# EasyEDA Pro project ProPrj_IRIS_2026-04-15_COMPLETE.epro, board PCB1
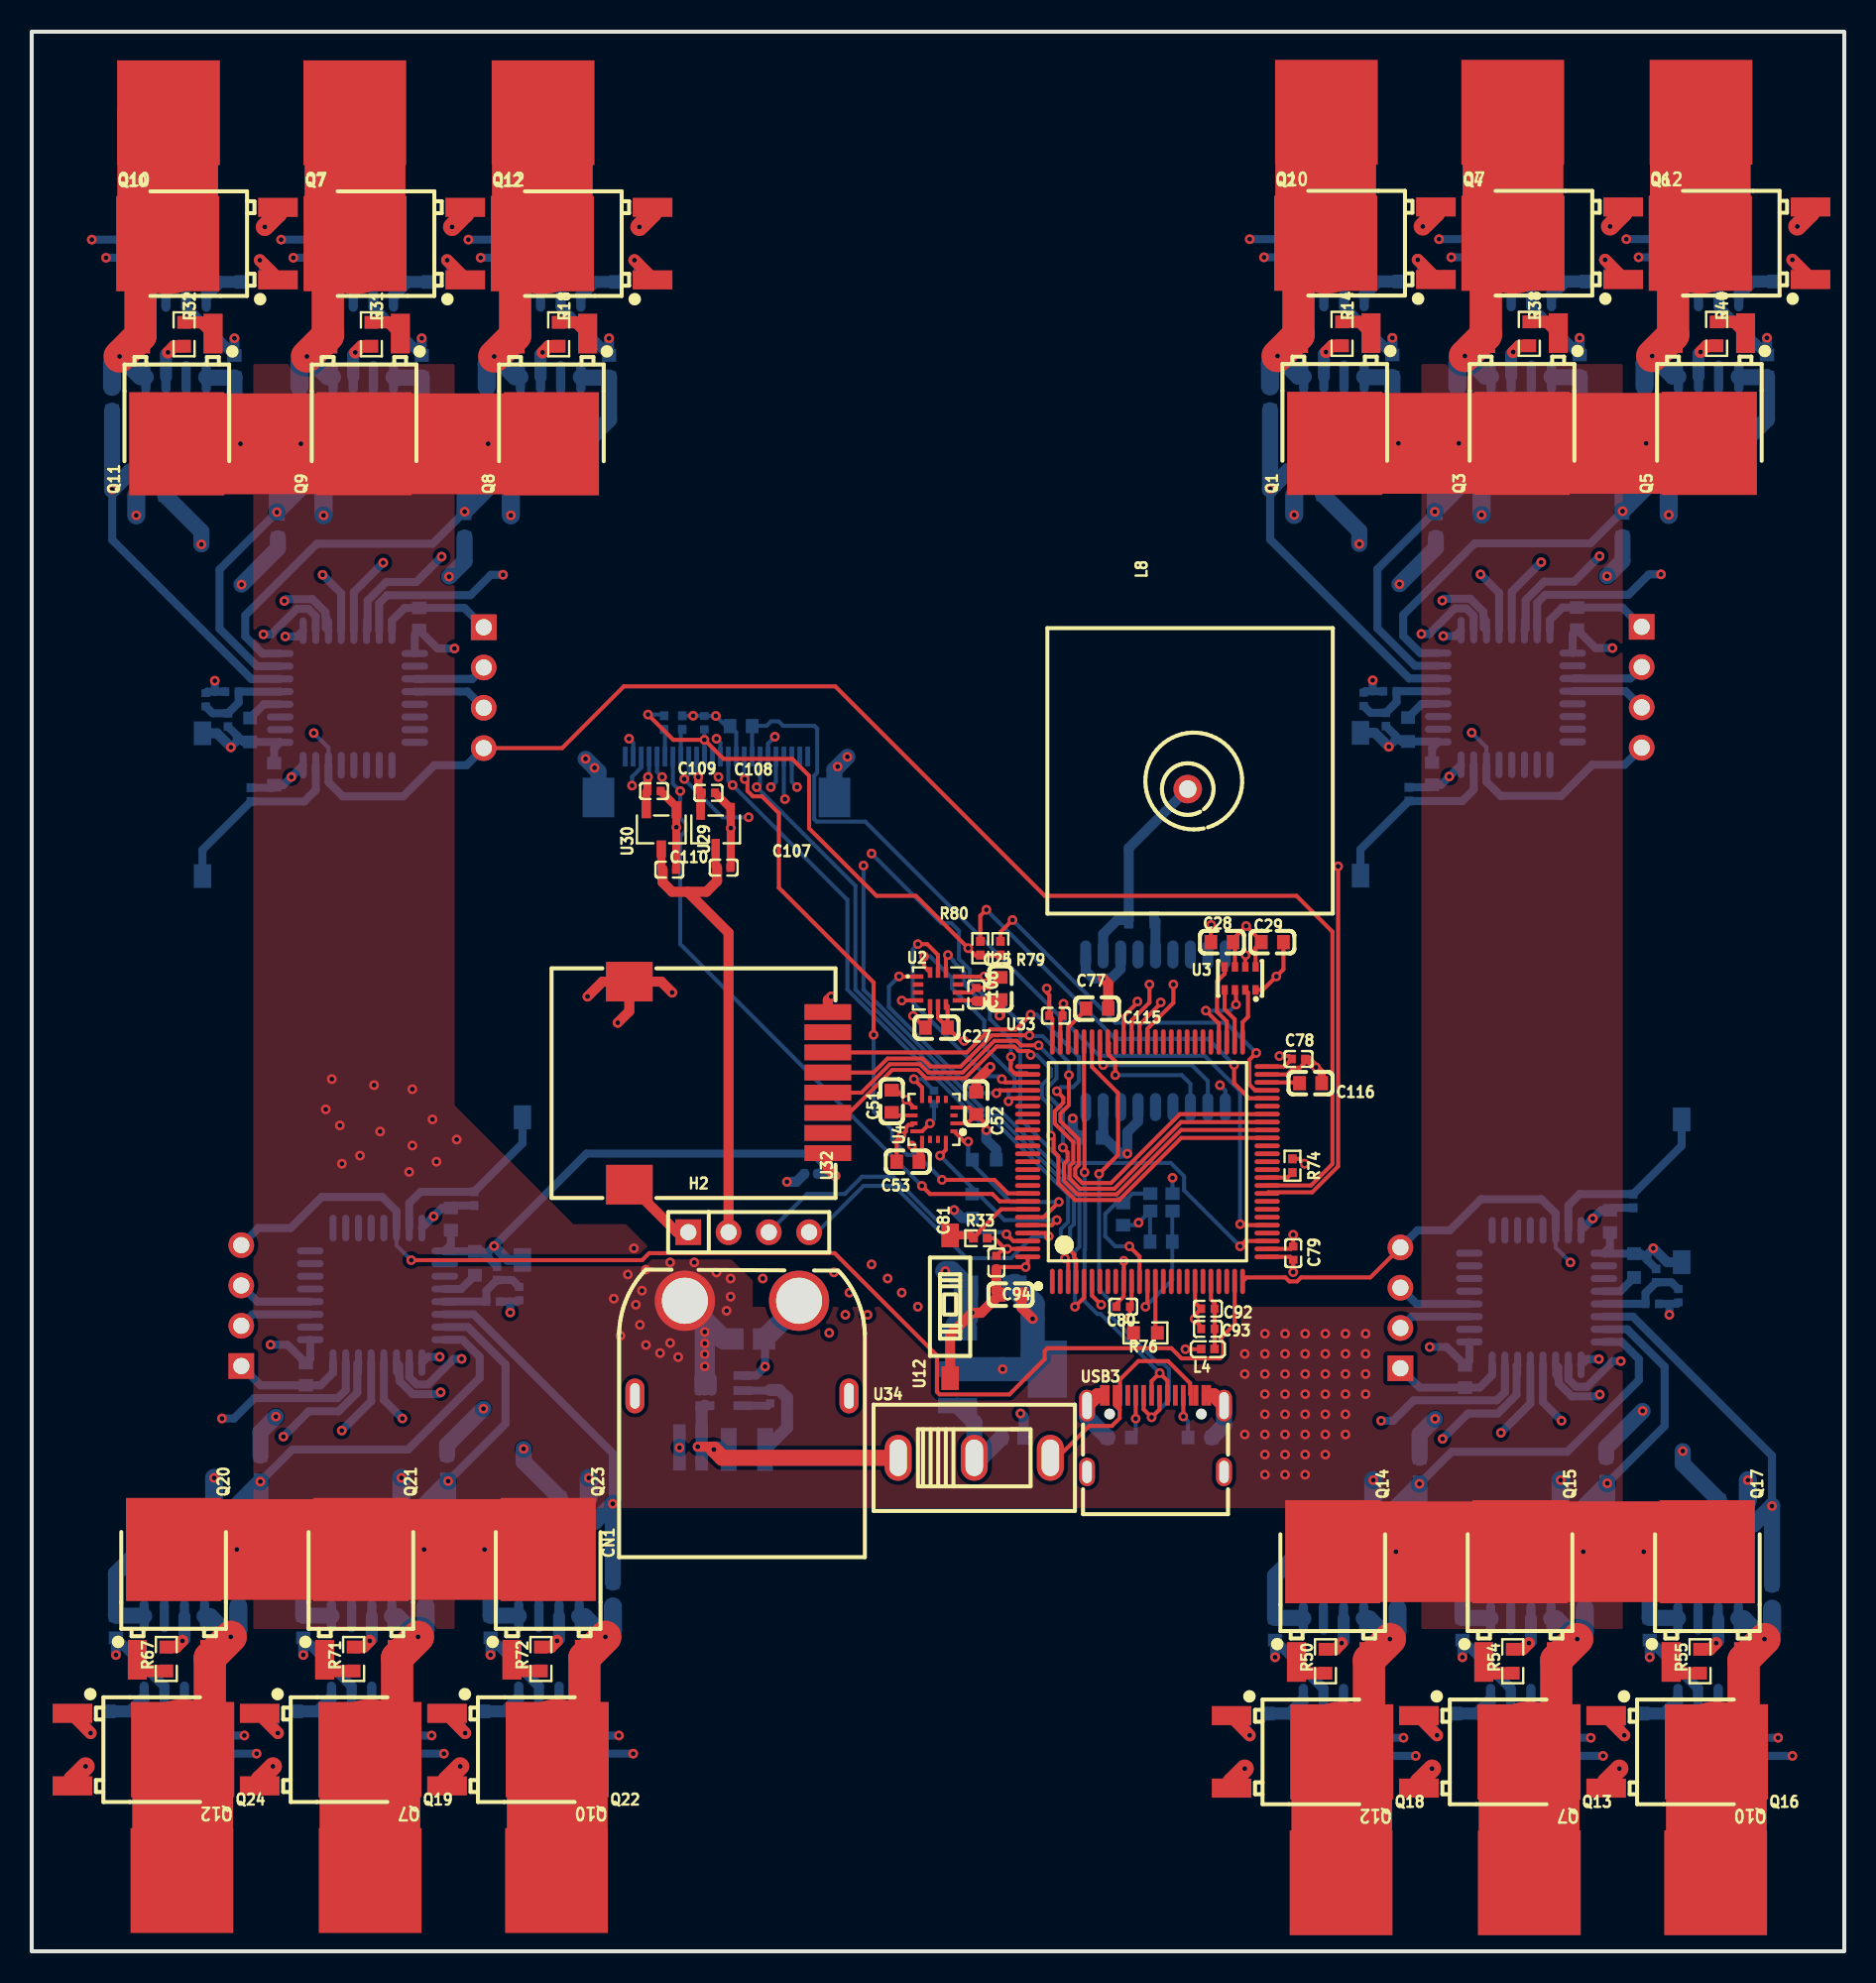
[diagram p2: board, top side]
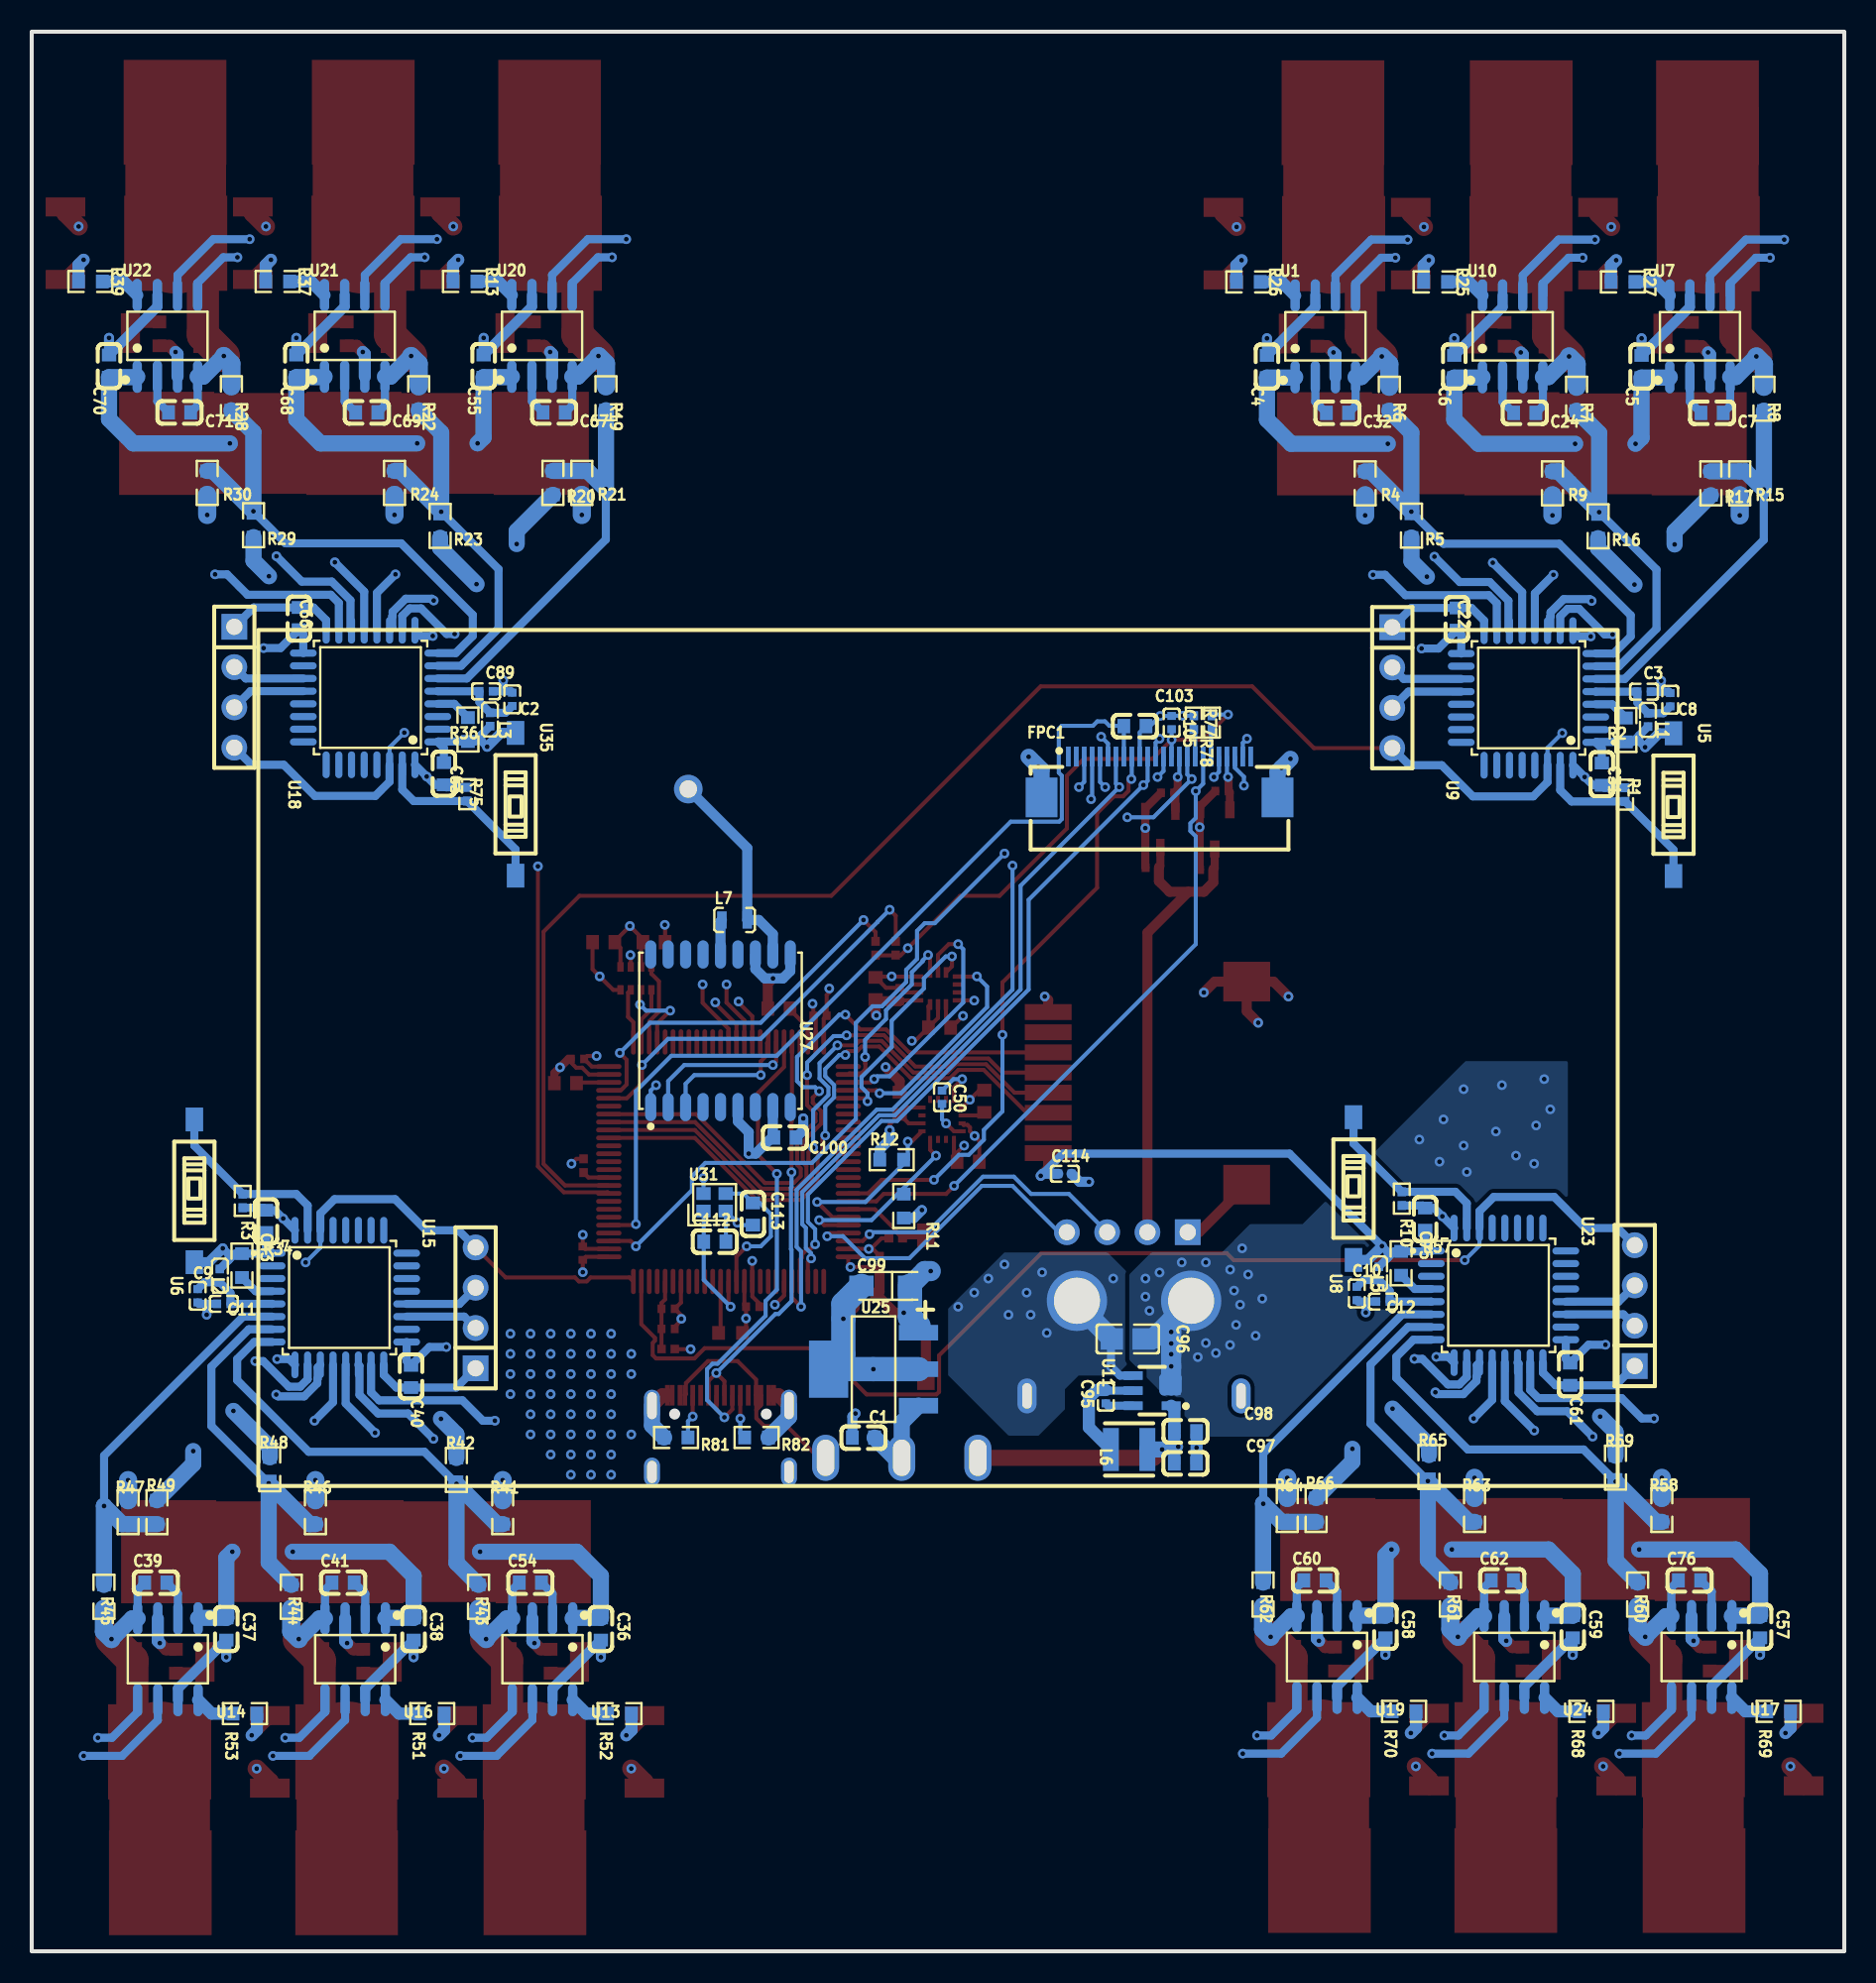
[diagram p3: board, bottom side, seen from below]

Outline 114.3 x 121.03 mm; copper layers: Top Layer, Ground, Power, Bottom Layer. Coordinates in mm from the lower left corner of the outline.
Outline path: rectangle 0,121.03 114.3,0
Stack: Top Layer 0.035mm Outer layer thickness 1oz / Dielectric1 0.2104mm 7628 RC49% 8.6mil / Ground 0.0152mm Inner layer thickness / Dielectric2 1.065mm 1.1mm H/HOZ Copper / Power 0.0152mm Inner layer thickness / Dielectric3 0.2104mm 7628 RC49% 8.6mil / Bottom Layer 0.035mm Outer layer thickness 1oz

## Design rules (mm)
template: Custom Config
spacing copperThickness1oz (default): track to track 0.102, other pairs 0.152 to 0.3
spacing copperThickness2oz: track to track 0.203, other pairs 0.152 to 0.3
track width copperThickness1oz (default): min 0.127, default 0.254, max 2.54
track width copperThickness2oz: min 0.203, default 0.254, max 2.54
differential pair differentialPair (default): width min 0.127, default 0.254, max 2.54; gap min 0.152, default 0.152
via viaSize (default): diameter min 0.5, default 0.61, max 10; hole min 0.3, default 0.305, max 6.3
pour e3935 uses copperRegion1
pour e4184 uses copperRegion1
pour e4060 uses copperRegion1
pour e4111 uses copperRegion1
pour e4183 uses copperRegion1
pour e397 uses copperRegion1
pour e567 uses copperRegion1
pour e182 uses copperRegion1
pour e292 uses copperRegion1
pour e393 uses copperRegion1

## Placement (name value [footprint] x y rotation side)
C1  10uF  [C0603]  61.85 32.38 180 bottom
C2  1uF  [C0402]  84 78.94 270 bottom
C3  100nF  [C0402]  12.63 79.42 180 bottom
C4  10uF  [C0603]  36.41 99.92 270 bottom
C5  10uF  [C0603]  12.78 99.92 270 bottom
C6  10uF  [C0603]  24.59 99.92 270 bottom
C7  100nF  [C0603]  8.34 97 0 bottom
C8  1uF  [C0402]  10.98 78.91 270 bottom
C9  1uF  [C0402]  103.84 41.33 90 bottom
C10  1uF  [C0402]  30.74 41.47 90 bottom
C11  100nF  [C0402]  102.18 40.82 0 bottom
C12  100nF  [C0402]  29.09 40.96 0 bottom
C22  100nF  [C0603]  24.43 84 270 bottom
C24  100nF  [C0603]  20.15 97 0 bottom
C25  2.2uF  [C0603]  61.09 60.71 270 top
C27  10nF  [C0603]  57.05 58.24 180 top
C28  100nF  [C0603]  75.06 63.63 180 top
C29  100nF  [C0603]  78.23 63.63 0 top
C31  100nF  [C0603]  15.29 74.22 270 bottom
C32  100nF  [C0603]  31.96 97 0 bottom
C36  10uF  [C0603]  78.41 20.32 90 bottom
C37  10uF  [C0603]  102.03 20.32 90 bottom
C38  10uF  [C0603]  90.22 20.32 90 bottom
C39  100nF  [C0603]  106.48 23.24 180 bottom
C40  100nF  [C0603]  90.38 36.24 90 bottom
C41  100nF  [C0603]  94.66 23.24 180 bottom
C43  100nF  [C0603]  99.53 46.02 90 bottom
C50  220nF  [C0402]  56.9 53.85 270 bottom
C51  4.7uF  [C0603]  54.23 53.59 90 top
C52  100nF  [C0603]  59.56 53.47 90 top
C53  100nF  [C0603]  55.25 49.78 180 top
C54  100nF  [C0603]  82.85 23.24 180 bottom
C55  10uF  [C0603]  85.8 99.95 270 bottom
C57  10uF  [C0603]  5.31 20.46 90 bottom
C58  10uF  [C0603]  28.94 20.46 90 bottom
C59  10uF  [C0603]  17.12 20.46 90 bottom
C60  100nF  [C0603]  33.38 23.38 180 bottom
C61  100nF  [C0603]  17.29 36.39 90 bottom
C62  100nF  [C0603]  21.57 23.38 180 bottom
C63  100nF  [C0603]  88.31 74.25 270 bottom
C66  100nF  [C0603]  97.45 84.03 270 bottom
C67  100nF  [C0603]  81.36 97.03 0 bottom
C68  10uF  [C0603]  97.61 99.95 270 bottom
C69  100nF  [C0603]  93.17 97.03 0 bottom
C70  10uF  [C0603]  109.42 99.95 270 bottom
C71  100nF  [C0603]  104.98 97.03 0 bottom
C75  100nF  [C0603]  26.43 46.16 90 bottom
C76  100nF  [C0603]  9.76 23.38 180 bottom
C77  100nF  [C0402]  64.59 58.99 180 top
C78  100nF  [C0402]  79.88 56.26 180 top
C79  100nF  [C0402]  79.55 44.02 90 top
C80  100nF  [C0402]  68.83 40.64 0 top
C81  100nF  [C0402]  60.83 43.43 270 top
C89  100nF  [C0402]  85.65 79.45 180 bottom
C92  100nF  [C0402]  74.17 40.51 0 top
C93  1uF  [C0402]  74.17 39.24 0 top
C94  4.7uF  [C0603]  61.72 41.4 0 top
C95  100nF  [C0402]  46.57 34.97 270 bottom
C96  10uF  [C0805]  45.18 38.61 180 bottom
C97  22uF  [C0603]  41.55 30.76 0 bottom
C98  22uF  [C0603]  41.54 32.78 0 bottom
C99  10uF  [CAP-SMD_L3.2-W1.6-RD-C7171]  60.45 41.96 0 bottom
C100  10uF  [C0603]  66.8 51.31 0 bottom
C103  15pF  [C0603]  44.73 77.25 0 bottom
C105  100nF  [C0402]  42.42 77.47 270 bottom
C106  100nF  [C0402]  59.56 60.32 90 top
C107  1uF  [C0402]  43.64 68.33 180 top
C108  1uF  [C0402]  42.67 73.04 180 top
C109  1uF  [C0402]  39.24 73.15 180 top
C110  1uF  [C0402]  40.21 68.2 180 top
C112  10pF  [C0603]  71.22 44.74 180 bottom
C113  10pF  [C0603]  68.82 46.48 270 bottom
C114  100nF  [C0402]  49.15 49.02 180 bottom
C115  2.2uF  [C0603]  67.18 59.44 180 top
C116  2.2uF  [C0603]  80.65 54.74 180 top
CN1  XT60PW-M  [CONN-TH_XT60PW-M]  44.79 38.02 90 top
FPC1  FPC-05F-24PH20  [FPC-SMD_24P-P0.50_FPC-05F-24PH20]  43.18 74.04 180 bottom
H1  HX PH254-01-04-Z-L11.5 straight pin header  [HDR-TH_4P-HX-PH254-01-04-Z-L11.5]  101.52 79.7 270 bottom
H2  HX PH254-01-04-Z-L11.5 straight pin header  [HDR-TH_4P-HX-PH254-01-04-Z-L11.5]  45.21 45.34 0 top
H3  HX PH254-01-04-Z-L11.5 straight pin header  [HDR-TH_4P-HX-PH254-01-04-Z-L11.5]  28.5 79.67 270 bottom
H4  HX PH254-01-04-Z-L11.5 straight pin header  [HDR-TH_4P-HX-PH254-01-04-Z-L11.5]  86.31 40.57 90 bottom
H5  HX PH254-01-04-Z-L11.5 straight pin header  [HDR-TH_4P-HX-PH254-01-04-Z-L11.5]  13.21 40.71 90 bottom
L1  BLM15PD121SN1D  [L0402]  12.37 77.64 270 bottom
L2  BLM15PD121SN1D  [L0402]  102.44 42.6 90 bottom
L3  BLM15PD121SN1D  [L0402]  85.39 77.67 270 bottom
L4  BLM15PD121SN1D  [L0402]  74.17 37.97 0 top
L5  BLM15PD121SN1D  [L0402]  29.34 42.74 90 bottom
L6  4.7uH  [IND-SMD_L3.0-W3.0-1]  45.1 31.64 180 bottom
L7  47nH  [IND-SMD_L1.8-W1.0]  69.98 65.02 180 bottom
L8  BWGNSCNX18-18W4  [ANT-TH_L18.0-W18.0_C9900026472]  72.9 73.28 0 top
NOREF  -  [Pad_e2432]  9.47 4.46 0 top
NOREF#2  -  [Pad_e2002]  106.19 4.32 0 top
NOREF#3  -  [Pad_e844]  105.27 115.95 180 top
NOREF#4  -  [Pad_e843]  81.64 115.95 180 top
NOREF#5  -  [Pad_e2000]  94.44 4.32 0 top
NOREF#6  -  [Pad_e2433]  33.09 4.46 0 top
NOREF#7  -  [Pad_e4100]  20.37 115.92 180 top
NOREF#8  -  [Pad_e2431]  21.35 4.46 0 top
NOREF#9  -  [Pad_e2001]  82.57 4.32 0 top
NOREF#10  -  [Pad_e845]  93.39 115.95 180 top
NOREF#11  -  [Pad_e4103]  32.25 115.92 180 top
NOREF#12  -  [Pad_e4104]  8.62 115.92 180 top
Q1  IRLR7843TRPBF  [TO-252-3_L6.6-W6.1-P4.57-LS9.9-BR-CW]  82.17 98.55 90 top
Q2  IRLR7843TRPBF  [TO-252-3_L6.6-W6.1-P4.57-LS9.9-BR-CW]  85.07 107.7 0 top
Q3  IRLR7843TRPBF  [TO-252-3_L6.6-W6.1-P4.57-LS9.9-BR-CW]  93.98 98.55 90 top
Q4  IRLR7843TRPBF  [TO-252-3_L6.6-W6.1-P4.57-LS9.9-BR-CW]  96.88 107.7 0 top
Q5  IRLR7843TRPBF  [TO-252-3_L6.6-W6.1-P4.57-LS9.9-BR-CW]  105.79 98.55 90 top
Q6  IRLR7843TRPBF  [TO-252-3_L6.6-W6.1-P4.57-LS9.9-BR-CW]  108.69 107.7 0 top
Q7  IRLR7843TRPBF  [TO-252-3_L6.6-W6.1-P4.57-LS9.9-BR-CW]  23.86 107.67 0 top
Q8  IRLR7843TRPBF  [TO-252-3_L6.6-W6.1-P4.57-LS9.9-BR-CW]  32.77 98.52 90 top
Q9  IRLR7843TRPBF  [TO-252-3_L6.6-W6.1-P4.57-LS9.9-BR-CW]  20.96 98.52 90 top
Q10  IRLR7843TRPBF  [TO-252-3_L6.6-W6.1-P4.57-LS9.9-BR-CW]  12.05 107.67 0 top
Q11  IRLR7843TRPBF  [TO-252-3_L6.6-W6.1-P4.57-LS9.9-BR-CW]  9.15 98.52 90 top
Q12  IRLR7843TRPBF  [TO-252-3_L6.6-W6.1-P4.57-LS9.9-BR-CW]  35.68 107.67 0 top
Q13  IRLR7843TRPBF  [TO-252-3_L6.6-W6.1-P4.57-LS9.9-BR-CW]  90.95 12.57 180 top
Q14  IRLR7843TRPBF  [TO-252-3_L6.6-W6.1-P4.57-LS9.9-BR-CW]  82.04 21.72 270 top
Q15  IRLR7843TRPBF  [TO-252-3_L6.6-W6.1-P4.57-LS9.9-BR-CW]  93.85 21.72 270 top
Q16  IRLR7843TRPBF  [TO-252-3_L6.6-W6.1-P4.57-LS9.9-BR-CW]  102.76 12.57 180 top
Q17  IRLR7843TRPBF  [TO-252-3_L6.6-W6.1-P4.57-LS9.9-BR-CW]  105.66 21.72 270 top
Q18  IRLR7843TRPBF  [TO-252-3_L6.6-W6.1-P4.57-LS9.9-BR-CW]  79.14 12.57 180 top
Q19  IRLR7843TRPBF  [TO-252-3_L6.6-W6.1-P4.57-LS9.9-BR-CW]  17.85 12.71 180 top
Q20  IRLR7843TRPBF  [TO-252-3_L6.6-W6.1-P4.57-LS9.9-BR-CW]  8.95 21.86 270 top
Q21  IRLR7843TRPBF  [TO-252-3_L6.6-W6.1-P4.57-LS9.9-BR-CW]  20.76 21.86 270 top
Q22  IRLR7843TRPBF  [TO-252-3_L6.6-W6.1-P4.57-LS9.9-BR-CW]  29.67 12.71 180 top
Q23  IRLR7843TRPBF  [TO-252-3_L6.6-W6.1-P4.57-LS9.9-BR-CW]  32.57 21.86 270 top
Q24  IRLR7843TRPBF  [TO-252-3_L6.6-W6.1-P4.57-LS9.9-BR-CW]  6.04 12.71 180 top
R1  10kΩ  [R0402]  13.82 72.93 90 bottom
R2  10kΩ  [R0603]  13.77 77.01 90 bottom
R3  10kΩ  [R0402]  101 47.31 270 bottom
R4  10kΩ  [R0603]  30.21 92.56 90 bottom
R5  33kΩ  [R0603]  27.29 89.89 90 bottom
R6  33kΩ  [R0603]  28.69 97.89 90 bottom
R7  33kΩ  [R0603]  16.88 97.89 90 bottom
R8  33kΩ  [R0603]  5.07 97.89 90 bottom
R9  10kΩ  [R0603]  18.4 92.56 90 bottom
R10  10kΩ  [R0402]  27.9 47.45 270 bottom
R11  2.2kΩ  [R0603]  59.31 46.99 90 bottom
R12  2.2kΩ  [R0603]  60.07 49.91 180 bottom
R13  100Ω  [R0603]  86.98 105.28 0 bottom
R14  100Ω  [R0603]  82.63 101.98 90 top
R15  10kΩ  [R0603]  6.59 92.56 90 bottom
R16  33kΩ  [R0603]  15.52 89.85 90 bottom
R17  33kΩ  [R0603]  8.41 92.56 90 bottom
R18  100Ω  [R0603]  33.23 101.95 90 top
R19  33kΩ  [R0603]  78.09 97.92 90 bottom
R20  33kΩ  [R0603]  81.43 92.58 90 bottom
R21  10kΩ  [R0603]  79.61 92.58 90 bottom
R22  33kΩ  [R0603]  89.9 97.92 90 bottom
R23  33kΩ  [R0603]  88.54 89.87 90 bottom
R24  10kΩ  [R0603]  91.42 92.58 90 bottom
R25  100Ω  [R0603]  25.77 105.26 0 bottom
R26  100Ω  [R0603]  37.58 105.26 0 bottom
R27  100Ω  [R0603]  13.96 105.26 0 bottom
R28  33kΩ  [R0603]  101.71 97.92 90 bottom
R29  33kΩ  [R0603]  100.31 89.92 90 bottom
R30  10kΩ  [R0603]  103.23 92.58 90 bottom
R31  100Ω  [R0603]  21.42 101.95 90 top
R32  100Ω  [R0603]  9.61 101.95 90 top
R33  10kΩ  [R0402]  59.82 44.96 0 top
R34  10kΩ  [R0603]  101.04 43.24 270 bottom
R36  10kΩ  [R0603]  86.79 77.03 90 bottom
R37  100Ω  [R0603]  98.79 105.28 0 bottom
R38  100Ω  [R0603]  94.44 101.98 90 top
R39  100Ω  [R0603]  110.6 105.28 0 bottom
R40  100Ω  [R0603]  106.25 101.98 90 top
R41  10kΩ  [R0603]  84.6 27.69 270 bottom
R42  33kΩ  [R0603]  87.52 30.35 270 bottom
R43  33kΩ  [R0603]  86.12 22.35 270 bottom
R44  33kΩ  [R0603]  97.93 22.35 270 bottom
R45  33kΩ  [R0603]  109.75 22.35 270 bottom
R46  10kΩ  [R0603]  96.41 27.69 270 bottom
R47  10kΩ  [R0603]  108.22 27.69 270 bottom
R48  33kΩ  [R0603]  99.29 30.39 270 bottom
R49  33kΩ  [R0603]  106.4 27.69 270 bottom
R50  100Ω  [R0603]  81.58 18.29 270 top
R51  100Ω  [R0603]  89.04 14.99 180 bottom
R52  100Ω  [R0603]  77.23 14.99 180 bottom
R53  100Ω  [R0603]  100.86 14.99 180 bottom
R54  100Ω  [R0603]  93.39 18.29 270 top
R55  100Ω  [R0603]  105.21 18.29 270 top
R57  10kΩ  [R0603]  27.95 43.38 270 bottom
R58  10kΩ  [R0603]  11.5 27.83 270 bottom
R59  33kΩ  [R0603]  14.43 30.49 270 bottom
R60  33kΩ  [R0603]  13.03 22.49 270 bottom
R61  33kΩ  [R0603]  24.84 22.49 270 bottom
R62  33kΩ  [R0603]  36.65 22.49 270 bottom
R63  10kΩ  [R0603]  23.32 27.83 270 bottom
R64  10kΩ  [R0603]  35.13 27.83 270 bottom
R65  33kΩ  [R0603]  26.19 30.54 270 bottom
R66  33kΩ  [R0603]  33.31 27.83 270 bottom
R67  100Ω  [R0603]  8.49 18.43 270 top
R68  100Ω  [R0603]  15.95 15.13 180 bottom
R69  100Ω  [R0603]  4.14 15.13 180 bottom
R70  100Ω  [R0603]  27.76 15.13 180 bottom
R71  100Ω  [R0603]  20.3 18.43 270 top
R72  100Ω  [R0603]  32.11 18.43 270 top
R74  10kΩ  [R0402]  79.5 49.53 90 top
R75  10kΩ  [R0402]  86.84 72.96 90 bottom
R76  10kΩ  [R0603]  70.23 38.99 0 top
R77  1kΩ  [R0402]  41.02 77.47 270 bottom
R78  4.7kΩ  [R0402]  39.88 77.47 270 bottom
R79  4.7kΩ  [R0402]  61.09 63.25 90 top
R80  4.7kΩ  [R0402]  59.82 63.25 90 top
R81  5.1kΩ  [R0603]  73.67 32.4 0 bottom
R82  5.1kΩ  [R0603]  68.59 32.4 0 bottom
U1  MIC4604YM-TR  [SOIC-8_L4.9-W3.9-P1.27-LS6.0-BL]  32.72 101.83 180 bottom
U2  ICM-42688-P  [LGA-14_L3.0-W2.5-P0.50-TL]  57.15 60.71 0 top
U3  BMP280  [LGA-8_L2.5-W2.0-P0.65_AMP6127]  76.2 61.34 270 top
U4  QMC5883L  [LGA-16_L3.0-W3.0-P0.50-BL_SQ]  56.9 52.45 90 top
U5  2.54-1P TPGT  [SW-SMD_2P-L6.2-W2.5-LS9.4]  10.77 72.29 270 bottom
U6  2.54-1P TPGT  [SW-SMD_2P-L6.2-W2.5-LS9.4]  104.04 47.95 90 bottom
U7  MIC4604YM-TR  [SOIC-8_L4.9-W3.9-P1.27-LS6.0-BL]  9.1 101.83 180 bottom
U8  2.54-1P TPGT  [SW-SMD_2P-L6.2-W2.5-LS9.4]  30.95 48.09 90 bottom
U9  AT32F421K8T7  [LQFP-32_L7.0-W7.0-P0.80-LS9.0-BL]  19.91 79.02 90 bottom
U10  MIC4604YM-TR  [SOIC-8_L4.9-W3.9-P1.27-LS6.0-BL]  20.91 101.83 180 bottom
U11  AP63205WU-7  [TSOT-23-6_L2.9-W1.6-P0.95-LS2.8-BL]  43.65 35.35 90 bottom
U12  2.54-1P TPGT  [SW-SMD_2P-L6.2-W2.5-LS9.4]  57.91 40.64 90 top
U13  MIC4604YM-TR  [SOIC-8_L4.9-W3.9-P1.27-LS6.0-BL]  82.09 18.41 0 bottom
U14  MIC4604YM-TR  [SOIC-8_L4.9-W3.9-P1.27-LS6.0-BL]  105.71 18.41 0 bottom
U15  AT32F421K8T7  [LQFP-32_L7.0-W7.0-P0.80-LS9.0-BL]  94.9 41.22 270 bottom
U16  MIC4604YM-TR  [SOIC-8_L4.9-W3.9-P1.27-LS6.0-BL]  93.9 18.41 0 bottom
U17  MIC4604YM-TR  [SOIC-8_L4.9-W3.9-P1.27-LS6.0-BL]  9 18.56 0 bottom
U18  AT32F421K8T7  [LQFP-32_L7.0-W7.0-P0.80-LS9.0-BL]  92.93 79.05 90 bottom
U19  MIC4604YM-TR  [SOIC-8_L4.9-W3.9-P1.27-LS6.0-BL]  32.62 18.56 0 bottom
U20  MIC4604YM-TR  [SOIC-8_L4.9-W3.9-P1.27-LS6.0-BL]  82.12 101.85 180 bottom
U21  MIC4604YM-TR  [SOIC-8_L4.9-W3.9-P1.27-LS6.0-BL]  93.93 101.85 180 bottom
U22  MIC4604YM-TR  [SOIC-8_L4.9-W3.9-P1.27-LS6.0-BL]  105.74 101.85 180 bottom
U23  AT32F421K8T7  [LQFP-32_L7.0-W7.0-P0.80-LS9.0-BL]  21.8 41.36 270 bottom
U24  MIC4604YM-TR  [SOIC-8_L4.9-W3.9-P1.27-LS6.0-BL]  20.81 18.56 0 bottom
U25  MIC39100-3.3WS-TR  [SOT-223-4_L6.5-W3.5-P2.30-LS7.0-BR]  61.21 36.7 180 bottom
U27  ATGM336H-5N31  [GPSM-SMD_ATGM336H-TR]  70.87 58.04 0 bottom
U29  XC6206-1.2V  [SOT-23-3_L3.0-W1.6-P1.90-LS2.8-BR]  43.13 70.74 90 top
U30  XC6206-2.8V  [SOT-23-3_L2.9-W1.6-P1.90-LS2.8-BR]  39.7 70.74 90 top
U31  48MHz  [CRYSTAL-SMD_4P-L2.0-W1.6-BL]  71.24 47.22 180 bottom
U32  E01C-ML01SP4  [COMM-SMD_E01C-ML01SP4]  43.94 54.74 270 top
U33  STM32H743VIT6  [LQFP-100_L14.0-W14.0-P0.50-LS16.0-BL]  70.36 49.78 0 top
U34  SS12D10G5  [SW-TH_SHOU-HAN_SS12D10G4]  59.44 31.11 0 top
U35  2.54-1P TPGT  [SW-SMD_2P-L6.2-W2.5-LS9.4]  83.79 72.32 270 bottom
USB3  -  [USB-C-SMD_KH-TYPE-C-16P]  70.87 32.64 0 top

## Footprints (pads in the part's own frame, mm; a bottom-side part is the same pattern mirrored in y, then rotated)
ANT-TH_L18.0-W18.0_C9900026472
  round 1.8 hole 1.1: 1(0,0)
C0402
  rect 0.5x0.54 smd: 1(-0.42,0) 2(0.42,0)
C0603
  rect 0.8x0.9 smd: 1(-0.7,0) 2(0.7,0)
C0805
  rect 1.41x1.35 smd: 1(-1,0) 2(1,0)
CAP-SMD_L3.2-W1.6-RD-C7171
  rect 1.53x1.296 smd: 1(-1.53,0) 2(1.53,0)
COMM-SMD_E01C-ML01SP4
  rect 1x2.95 smd: 1(4.41,6.26) 2(3.14,6.26) 3(1.87,6.26) 4(0.6,6.26) 5(-0.67,6.26) 6(-1.94,6.26) 7(-3.21,6.26) 8(-4.48,6.26)
  rect 2.5x2.95 smd: 9(-6.4,-6.26) 10(6.4,-6.255)
CONN-TH_XT60PW-M
  round 3.8 hole 2.9: 1(3,-3.6) 2(3,3.6)
  oval 2.2x1.2 hole 1.6x0.6: 3(-3,6.75) 4(-3,-6.75)
CRYSTAL-SMD_4P-L2.0-W1.6-BL
  rect 0.9x0.8 smd: 1(-0.7,-0.55) 2(0.7,-0.55) 3(0.7,0.55) 4(-0.7,0.55)
FPC-SMD_24P-P0.50_FPC-05F-24PH20
  rect 0.3x1.25 smd: 1(-5.75,1.288) 2(-5.25,1.288) 3(-4.75,1.288) 4(-4.25,1.288) 5(-3.75,1.288) 6(-3.25,1.288) 7(-2.75,1.288) 8(-2.25,1.288) 9(-1.75,1.288) 10(-1.25,1.288) 11(-0.75,1.288) 12(-0.25,1.288) 13(0.25,1.288) 14(0.75,1.288) 15(1.25,1.288) 16(1.75,1.288) 17(2.25,1.288) 18(2.75,1.288) 19(3.25,1.288) 20(3.75,1.288) 21(4.25,1.288) 22(4.75,1.288) 23(5.25,1.288) 24(5.75,1.288)
  rect 2x2.5 smd: 25(7.44,-1.288) 26(-7.44,-1.288)
GPSM-SMD_ATGM336H-TR
  oval 0.7x1.773 smd: 1(4.4,4.811) 2(3.3,4.811) 3(2.2,4.811) 4(1.1,4.811) 5(0,4.811) 6(-1.1,4.811) 7(-2.2,4.811) 8(-3.3,4.811) 9(-4.4,4.811) 10(-4.4,-4.811) 11(-3.3,-4.811) 12(-2.2,-4.811) 13(-1.1,-4.811) 14(0,-4.811) 15(1.1,-4.811) 16(2.2,-4.811) 17(3.3,-4.811) 18(4.4,-4.811)
HDR-TH_4P-HX-PH254-01-04-Z-L11.5
  rect 1.62x1.62 hole 1.02: 1(-3.81,0)
  round 1.62 hole 1.02: 2(-1.27,0) 3(1.27,0) 4(3.81,0)
IND-SMD_L1.8-W1.0
  rect 0.6x1.08 smd: 1(-0.8,0) 2(0.8,0)
IND-SMD_L3.0-W3.0-1
  rect 1x2.7 smd: 1(-1.15,0) 2(1.15,0)
L0402
  rect 0.54x0.54 smd: 1(-0.42,0) 2(0.42,0)
LGA-8_L2.5-W2.0-P0.65_AMP6127
  rect 0.6x0.4 smd: 1(0.725,0.975) 2(0.725,0.325) 3(0.725,-0.325) 4(0.725,-0.975) 5(-0.725,-0.975) 6(-0.725,-0.325) 7(-0.725,0.325) 8(-0.725,0.975)
LGA-14_L3.0-W2.5-P0.50-TL
  rect 0.675x0.28 smd: 1(-1.262,0.75) 2(-1.262,0.25) 3(-1.262,-0.25) 4(-1.262,-0.75) 8(1.262,-0.75) 9(1.262,-0.25) 10(1.262,0.25) 11(1.262,0.75)
  rect 0.28x0.675 smd: 5(-0.5,-1.012) 6(0,-1.012) 7(0.5,-1.012) 12(0.5,1.012) 13(0,1.012) 14(-0.5,1.012)
LGA-16_L3.0-W3.0-P0.50-BL_SQ
  rect 0.25x0.45 smd: 1(-0.75,-1.263) 2(-0.25,-1.263) 3(0.25,-1.263) 4(0.75,-1.263) 9(0.75,1.263) 10(0.25,1.263) 11(-0.25,1.263) 12(-0.75,1.263)
  rect 0.45x0.25 smd: 5(1.263,-0.75) 6(1.263,-0.25) 7(1.263,0.25) 8(1.263,0.75) 13(-1.263,0.75) 14(-1.263,0.25) 15(-1.263,-0.25) 16(-1.263,-0.75)
LQFP-32_L7.0-W7.0-P0.80-LS9.0-BL
  oval 0.448x1.684 smd: 1(-2.8,-4.242) 2(-2,-4.242) 3(-1.2,-4.242) 4(-0.4,-4.242) 5(0.4,-4.242) 6(1.2,-4.242) 7(2,-4.242) 8(2.8,-4.242) 17(2.8,4.242) 18(2,4.242) 19(1.2,4.242) 20(0.4,4.242) 21(-0.4,4.242) 22(-1.2,4.242) 23(-2,4.242) 24(-2.8,4.242)
  oval 1.684x0.448 smd: 9(4.242,-2.8) 10(4.242,-2) 11(4.242,-1.2) 12(4.242,-0.4) 13(4.242,0.4) 14(4.242,1.2) 15(4.242,2) 16(4.242,2.8) 25(-4.242,2.8) 26(-4.242,2) 27(-4.242,1.2) 28(-4.242,0.4) 29(-4.242,-0.4) 30(-4.242,-1.2) 31(-4.242,-2) 32(-4.242,-2.8)
LQFP-100_L14.0-W14.0-P0.50-LS16.0-BL
  oval 0.3x1.6 smd: 1(-6,-7.55) 2(-5.5,-7.55) 3(-5,-7.55) 4(-4.5,-7.55) 5(-4,-7.55) 6(-3.5,-7.55) 7(-3,-7.55) 8(-2.5,-7.55) 9(-2,-7.55) 10(-1.5,-7.55) 11(-1,-7.55) 12(-0.5,-7.55) 13(0,-7.55) 14(0.5,-7.55) 15(1,-7.55) 16(1.5,-7.55) 17(2,-7.55) 18(2.5,-7.55) 19(3,-7.55) 20(3.5,-7.55) 21(4,-7.55) 22(4.5,-7.55) 23(5,-7.55) 24(5.5,-7.55) 25(6,-7.55) 51(6,7.55) 52(5.5,7.55) 53(5,7.55) 54(4.5,7.55) 55(4,7.55) 56(3.5,7.55) 57(3,7.55) 58(2.5,7.55) 59(2,7.55) 60(1.5,7.55) 61(1,7.55) 62(0.5,7.55) 63(0,7.55) 64(-0.5,7.55) 65(-1,7.55) 66(-1.5,7.55) 67(-2,7.55) 68(-2.5,7.55) 69(-3,7.55) 70(-3.5,7.55) 71(-4,7.55) 72(-4.5,7.55) 73(-5,7.55) 74(-5.5,7.55) 75(-6,7.55)
  oval 1.6x0.3 smd: 26(7.55,-6) 27(7.55,-5.5) 28(7.55,-5) 29(7.55,-4.5) 30(7.55,-4) 31(7.55,-3.5) 32(7.55,-3) 33(7.55,-2.5) 34(7.55,-2) 35(7.55,-1.5) 36(7.55,-1) 37(7.55,-0.5) 38(7.55,0) 39(7.55,0.5) 40(7.55,1) 41(7.55,1.5) 42(7.55,2) 43(7.55,2.5) 44(7.55,3) 45(7.55,3.5) 46(7.55,4) 47(7.55,4.5) 48(7.55,5) 49(7.55,5.5) 50(7.55,6) 76(-7.55,6) 77(-7.55,5.5) 78(-7.55,5) 79(-7.55,4.5) 80(-7.55,4) 81(-7.55,3.5) 82(-7.55,3) 83(-7.55,2.5) 84(-7.55,2) 85(-7.55,1.5) 86(-7.55,1) 87(-7.55,0.5) 88(-7.55,0) 89(-7.55,-0.5) 90(-7.55,-1) 91(-7.55,-1.5) 92(-7.55,-2) 93(-7.55,-2.5) 94(-7.55,-3) 95(-7.55,-3.5) 96(-7.55,-4) 97(-7.55,-4.5) 98(-7.55,-5) 99(-7.55,-5.5) 100(-7.55,-6)
Pad_e843
  custom 6.477x6.604 smd: 1(0,0)
Pad_e844
  custom 6.477x6.604 smd: 1(0,0)
Pad_e845
  custom 6.477x6.604 smd: 1(0,0)
Pad_e2000
  custom 6.477x6.604 smd: 1(0,0)
Pad_e2001
  custom 6.477x6.604 smd: 1(0,0)
Pad_e2002
  custom 6.477x6.604 smd: 1(0,0)
Pad_e2431
  custom 6.477x6.604 smd: 1(0,0)
Pad_e2432
  custom 6.477x6.604 smd: 1(0,0)
Pad_e2433
  custom 6.477x6.604 smd: 1(0,0)
Pad_e4100
  custom 6.477x6.604 smd: 1(0,0)
Pad_e4103
  custom 6.477x6.604 smd: 1(0,0)
Pad_e4104
  custom 6.477x6.604 smd: 1(0,0)
R0402
  rect 0.566x0.54 smd: 1(-0.433,0) 2(0.433,0)
R0603
  rect 0.806x0.864 smd: 1(-0.753,0) 2(0.753,0)
SOIC-8_L4.9-W3.9-P1.27-LS6.0-BL
  oval 0.588x2.045 smd: 1(-1.905,-2.57) 2(-0.635,-2.57) 3(0.635,-2.57) 4(1.905,-2.57) 5(1.905,2.57) 6(0.635,2.57) 7(-0.635,2.57) 8(-1.905,2.57)
SOT-23-3_L2.9-W1.6-P1.90-LS2.8-BR
  rect 1.07x0.6 smd: 1(1.235,-0.95) 2(1.235,0.95) 3(-1.235,0)
SOT-23-3_L3.0-W1.6-P1.90-LS2.8-BR
  rect 1.07x0.532 smd: 1(1.135,-0.95) 2(1.135,0.95) 3(-1.135,0)
SOT-223-4_L6.5-W3.5-P2.30-LS7.0-BR
  rect 2.47x0.98 smd: 1(2.835,-2.3) 2(2.835,0) 3(2.835,2.3)
  rect 2.47x3.6 smd: 4(-2.835,0)
SW-SMD_2P-L6.2-W2.5-LS9.4
  rect 1.5x1.1 smd: 1(-4.5,0) 2(4.5,0)
SW-TH_SHOU-HAN_SS12D10G4
  oval 1.7x2.9 hole 1.1x2.3: 1(-4.8,0) 2(0,0) 3(4.8,0)
TO-252-3_L6.6-W6.1-P4.57-LS9.9-BR-CW
  rect 2.5x1.2 smd: 1(3.475,-2.286) 3(3.475,2.286)
  rect 6.5x6 smd: 2(-3.475,0)
TSOT-23-6_L2.9-W1.6-P0.95-LS2.8-BL
  rect 0.55x1.2 smd: 1(-0.95,-1.2) 2(0,-1.2) 3(0.95,-1.2) 4(0.95,1.2) 5(0,1.2) 6(-0.95,1.2)
USB-C-SMD_KH-TYPE-C-16P
  oval 1x2 hole 0.6x1.7: 1(-4.32,1.765) 2(4.32,1.765)
  oval 1x1.8 hole 0.6x1.4: 3(-4.32,-2.415) 4(4.32,-2.415)
  rect 0.3x1.3 smd: A1(-3.35,2.415) A4(-2.55,2.415) A5(-1.25,2.415) A6(-0.25,2.415) A7(0.25,2.415) A8(1.25,2.415) A9(2.55,2.415) A12(3.35,2.415) B1(3.05,2.415) B4(2.25,2.415) B5(1.75,2.415) B6(0.75,2.415) B7(-0.75,2.415) B8(-1.75,2.415) B9(-2.25,2.415) B12(-3.05,2.415)

## Nets
1.2V: C108.2 FPC1.15 U29.2
2.8V: C109.2 FPC1.21 U30.2
3V3: C22.2 C25.2 C27.2 C28.1 C29.1 C31.1 C40.2 C43.1 C52.1 C53.1 C61.2 C63.1 C66.2 C75.1 C77.2 C78.2 C79.2 C80.2 C81.2 C94.1 C99.1 C100.2 C105.2 C106.1 C114.1 FPC1.14 L1.2 L2.2 L3.2 L4.1 L5.2 R2.1 R11.1 R12.1 R34.1 R36.1 R57.1 R76.1 R78.1 R79.1 R80.1 U2.5 U2.8 U3.6 U3.8 U4.2 U4.4 U4.13 U5.1 U6.1 U8.1 U9.1 U9.17 U12.1 U15.1 U15.17 U18.1 U18.17 U23.1 U23.17 U25.3 U27.6 U27.8 U32.1 U33.6 U33.11 U33.27 U33.50 U33.75 U33.100 U35.1
5V_USB: U34.3 USB3.A4 USB3.A9 USB3.B4 USB3.B9
7.4V_BATTERY: C4.2 C5.2 C6.2 C36.2 C37.2 C38.2 C55.2 C57.2 C58.2 C59.2 C68.2 C70.2 C96.2 CN1.2 Q1.2 Q3.2 Q5.2 Q8.2 Q9.2 Q11.2 Q14.2 Q15.2 Q17.2 Q20.2 Q21.2 Q23.2 U1.1 U7.1 U10.1 U11.2 U11.3 U13.1 U14.1 U16.1 U17.1 U19.1 U20.1 U21.1 U22.1 U24.1
+5V: C1.2 C107.2 C110.2 H2.2 U25.1 U29.3 U30.3 U34.2
GND: C1.1 C2.1 C3.2 C4.1 C5.1 C6.1 C8.1 C9.1 C10.1 C11.2 C12.2 C22.1 C25.1 C27.1 C28.2 C29.2 C31.2 C36.1 C37.1 C38.1 C40.1 C43.2 C51.2 C52.2 C53.2 C55.1 C57.1 C58.1 C59.1 C61.1 C63.2 C66.1 C68.1 C70.1 C75.2 C77.1 C78.1 C79.1 C80.1 C81.1 C89.2 C92.1 C93.1 C94.2 C96.1 C97.1 C98.1 C99.2 C100.1 C103.1 C105.1 C106.2 C107.1 C108.1 C109.1 C110.1 C112.2 C113.2 C114.2 C115.1 C116.1 CN1.1 CN1.3 CN1.4 FPC1.10 FPC1.23 FPC1.25 FPC1.26 H1.1 H2.1 H3.1 H4.1 H5.1 Q2.3 Q4.3 Q6.3 Q7.3 Q10.3 Q12.3 Q13.3 Q16.3 Q18.3 Q19.3 Q22.3 Q24.3 R1.2 R3.2 R4.1 R9.1 R10.2 R15.1 R21.1 R24.1 R30.1 R33.2 R41.1 R46.1 R47.1 R58.1 R63.1 R64.1 R74.2 R75.2 R77.1 R81.2 R82.1 U1.7 U2.6 U2.7 U2.9 U2.11 U3.1 U3.7 U4.9 U4.11 U7.7 U9.16 U9.32 U10.7 U11.4 U13.7 U14.7 U15.16 U15.32 U16.7 U17.7 U18.16 U18.32 U19.7 U20.7 U21.7 U22.7 U23.16 U23.32 U24.7 U25.2 U25.4 U27.1 U27.10 U27.12 U29.1 U30.1 U31.2 U31.4 U32.8 U32.9 U32.10 U33.10 U33.19 U33.26 U33.49 U33.74 U33.99 USB3.1 USB3.2 USB3.3 USB3.4 USB3.A1 USB3.A12 USB3.B1 USB3.B12
VDDA: C92.2 C93.2 L4.2 U33.21
$1I45090\$1N2344: Q5.1 R40.2
$1I45090\$1N2345: R40.1 U22.3
$1I45090\$1N2351: R37.1 U21.8
$1I45090\$1N2352: Q4.1 R37.2
$1I45090\$1N2355: C69.2 U21.2
$1I45090\$1N2357: R38.1 U21.3
$1I45090\$1N2360: R13.1 U20.8
$1I45090\$1N2365: Q3.1 R38.2
$1I45090\$1N2366: Q2.1 R13.2
$1I45090\$1N2369: C67.2 U20.2
$1I45090\$1N2370: R14.1 U20.3
$1I45090\$1N2372: Q1.1 R14.2
$1I45090\$1N2388: R36.2 U18.4
$1I45090\$1N2393: C71.2 U22.2
$1I45090\$1N2396: R39.1 U22.8
$1I45090\$1N2398: Q6.1 R39.2
$1I45090\$1N2406: C2.2 C89.1 L3.1 U18.5
$1I45090\A_REF: R20.1 R23.1 R29.1 U18.9
$1I45090\AU: R19.1 R20.2 R21.2 U18.6
$1I45090\AV: R22.1 R23.2 R24.2 U18.7
$1I45090\AW: R28.1 R29.2 R30.2 U18.8
$1I45090\BOOT0_ESC: R75.1 U18.31 U35.2
$1I45090\PHASE_U: C67.1 NOREF#4.1 Q1.3 Q2.2 R19.2 U20.4
$1I45090\PHASE_V: C69.1 NOREF#10.1 Q3.3 Q4.2 R22.2 U21.4
$1I45090\PHASE_W: C71.1 NOREF#3.1 Q5.3 Q6.2 R28.2 U22.4
$1I45090\UH: U18.11 U20.5
$1I45090\UL: U18.10 U20.6
$1I45090\USART1_RX: H1.3 U18.20
$1I45090\USART1_TX: H1.2 U18.19
$1I45090\VH: U18.13 U21.5
$1I45090\VL: U18.12 U21.6
$1I45090\WH: U18.15 U22.5
$1I45090\WL: U18.14 U22.6
$1I45112\$1N2344: Q8.1 R18.2
$1I45112\$1N2345: R18.1 U1.3
$1I45112\$1N2351: R25.1 U10.8
$1I45112\$1N2352: Q7.1 R25.2
$1I45112\$1N2355: C24.2 U10.2
$1I45112\$1N2357: R31.1 U10.3
$1I45112\$1N2360: R27.1 U7.8
$1I45112\$1N2365: Q9.1 R31.2
$1I45112\$1N2366: Q10.1 R27.2
$1I45112\$1N2369: C7.2 U7.2
$1I45112\$1N2370: R32.1 U7.3
$1I45112\$1N2372: Q11.1 R32.2
$1I45112\$1N2388: R2.2 U9.4
$1I45112\$1N2393: C32.2 U1.2
$1I45112\$1N2396: R26.1 U1.8
$1I45112\$1N2398: Q12.1 R26.2
$1I45112\$1N2406: C3.1 C8.2 L1.1 U9.5
$1I45112\A_REF: R5.1 R16.1 R17.1 U9.9
$1I45112\AU: R8.1 R15.2 R17.2 U9.6
$1I45112\AV: R7.1 R9.2 R16.2 U9.7
$1I45112\AW: R4.2 R5.2 R6.1 U9.8
$1I45112\BOOT0_ESC: R1.1 U5.2 U9.31
$1I45112\PHASE_U: C7.1 NOREF#12.1 Q10.2 Q11.3 R8.2 U7.4
$1I45112\PHASE_V: C24.1 NOREF#7.1 Q7.2 Q9.3 R7.2 U10.4
$1I45112\PHASE_W: C32.1 NOREF#11.1 Q8.3 Q12.2 R6.2 U1.4
$1I45112\UH: U7.5 U9.11
$1I45112\UL: U7.6 U9.10
$1I45112\USART1_RX: H3.3 U9.20
$1I45112\USART1_TX: H3.2 U9.19
$1I45112\VH: U9.13 U10.5
$1I45112\VL: U9.12 U10.6
$1I45112\WH: U1.5 U9.15
$1I45112\WL: U1.6 U9.14
$1I45134\$1N2344: Q14.1 R50.2
$1I45134\$1N2345: R50.1 U13.3
$1I45134\$1N2351: R51.1 U16.8
$1I45134\$1N2352: Q13.1 R51.2
$1I45134\$1N2355: C41.2 U16.2
$1I45134\$1N2357: R54.1 U16.3
$1I45134\$1N2360: R53.1 U14.8
$1I45134\$1N2365: Q15.1 R54.2
$1I45134\$1N2366: Q16.1 R53.2
$1I45134\$1N2369: C39.2 U14.2
$1I45134\$1N2370: R55.1 U14.3
$1I45134\$1N2372: Q17.1 R55.2
$1I45134\$1N2388: R34.2 U15.4
$1I45134\$1N2393: C54.2 U13.2
$1I45134\$1N2396: R52.1 U13.8
$1I45134\$1N2398: Q18.1 R52.2
$1I45134\$1N2406: C9.2 C11.1 L2.1 U15.5
$1I45134\A_REF: R42.1 R48.1 R49.1 U15.9
$1I45134\AU: R45.1 R47.2 R49.2 U15.6
$1I45134\AV: R44.1 R46.2 R48.2 U15.7
$1I45134\AW: R41.2 R42.2 R43.1 U15.8
$1I45134\BOOT0_ESC: R3.1 U6.2 U15.31
$1I45134\PHASE_U: C39.1 NOREF#2.1 Q16.2 Q17.3 R45.2 U14.4
$1I45134\PHASE_V: C41.1 NOREF#5.1 Q13.2 Q15.3 R44.2 U16.4
$1I45134\PHASE_W: C54.1 NOREF#9.1 Q14.3 Q18.2 R43.2 U13.4
$1I45134\UH: U14.5 U15.11
$1I45134\UL: U14.6 U15.10
$1I45134\USART1_RX: H4.3 U15.20
$1I45134\USART1_TX: H4.2 U15.19
$1I45134\VH: U15.13 U16.5
$1I45134\VL: U15.12 U16.6
$1I45134\WH: U13.5 U15.15
$1I45134\WL: U13.6 U15.14
$1I45156\$1N2344: Q20.1 R67.2
$1I45156\$1N2345: R67.1 U17.3
$1I45156\$1N2351: R68.1 U24.8
$1I45156\$1N2352: Q19.1 R68.2
$1I45156\$1N2355: C62.2 U24.2
$1I45156\$1N2357: R71.1 U24.3
$1I45156\$1N2360: R70.1 U19.8
$1I45156\$1N2365: Q21.1 R71.2
$1I45156\$1N2366: Q22.1 R70.2
$1I45156\$1N2369: C60.2 U19.2
$1I45156\$1N2370: R72.1 U19.3
$1I45156\$1N2372: Q23.1 R72.2
$1I45156\$1N2388: R57.2 U23.4
$1I45156\$1N2393: C76.2 U17.2
$1I45156\$1N2396: R69.1 U17.8
$1I45156\$1N2398: Q24.1 R69.2
$1I45156\$1N2406: C10.2 C12.1 L5.1 U23.5
$1I45156\A_REF: R59.1 R65.1 R66.1 U23.9
$1I45156\AU: R62.1 R64.2 R66.2 U23.6
$1I45156\AV: R61.1 R63.2 R65.2 U23.7
$1I45156\AW: R58.2 R59.2 R60.1 U23.8
$1I45156\BOOT0_ESC: R10.1 U8.2 U23.31
$1I45156\PHASE_U: C60.1 NOREF#6.1 Q22.2 Q23.3 R62.2 U19.4
$1I45156\PHASE_V: C62.1 NOREF#8.1 Q19.2 Q21.3 R61.2 U24.4
$1I45156\PHASE_W: C76.1 NOREF.1 Q20.3 Q24.2 R60.2 U17.4
$1I45156\UH: U19.5 U23.11
$1I45156\UL: U19.6 U23.10
$1I45156\USART1_RX: H5.3 U23.20
$1I45156\USART1_TX: H5.2 U23.19
$1I45156\VH: U23.13 U24.5
$1I45156\VL: U23.12 U24.6
$1I45156\WH: U17.5 U23.15
$1I45156\WL: U17.6 U23.14
BOOT0: R33.1 U12.2 U33.94
BOOT1: R74.1 U33.36
CAM_RST: FPC1.19 R78.2
CAM_XCLK: FPC1.12
DCMI_0: FPC1.6 U33.63
DCMI_1: FPC1.4 U33.64
DCMI_2: FPC1.3 U33.65
DCMI_3: FPC1.5 U33.66
DCMI_4: FPC1.7 U33.3
DCMI_5: FPC1.9 U33.92
DCMI_6: FPC1.11 U33.4
DCMI_7: FPC1.13 U33.5
DCMI_HSYNC: FPC1.16 U33.28
DCMI_PXLCLK: C103.2 FPC1.8 U33.30
DCMI_VSYNC: FPC1.18 U33.93
DM: U33.70 USB3.A7 USB3.B7
DP: U33.71 USB3.A6 USB3.B6
E01_CE: U32.2
E01_IRQ: U32.7
GPS_RX_MCU_TX: U27.3 U33.68
GPS_TX_MCU_RX: U27.2 U33.69
I2C1_SCLK: R12.2 U4.1 U33.95
I2C1_SDA: R11.2 U4.16 U33.96
I2C2_SCLK: FPC1.20 R80.2 U33.46
I2C2_SDA: FPC1.22 R79.2 U33.47
IMU_INT: U2.4
MOTOR1: H1.4 U18.30 U33.34
MOTOR2: H3.4 U9.30 U33.35
MOTOR3: H5.4 U23.30 U33.24
MOTOR4: H4.4 U15.30 U33.25
RADIO_RX: H2.4 U33.97
RADIO_TX: H2.3 U33.98
SPI2_CS: U3.2 U33.51
SPI2_MISO: U3.5 U33.53
SPI2_MOSI: U3.3 U33.54
SPI2_SCLK: U3.4 U33.52
SPI3_CS: U2.12 U33.77
SPI3_MISO: U2.1 U33.79
SPI3_MOSI: U2.14 U33.80
SPI3_SCLK: U2.13 U33.78
SPI4_CS: U32.3 U33.41
SPI4_MISO: U32.6 U33.43
SPI4_MOSI: U32.5 U33.44
SPI4_SCLK: U32.4 U33.42
XI_HS: C113.1 U31.3 U33.12
XO_HS: C112.1 U31.1 U33.13
$1N17368: C97.2 C98.2 L6.2 U11.1 U34.1
$1N17546: C95.1 L6.1 U11.5
$1N18305: C50.2 U4.12
$1N18391: C51.1 U4.10
$1N18545: C50.1 U4.8
$1N56559: C95.2 U11.6
$1N79325: L7.2 L8.1 U27.11
$1N79329: L7.1 U27.14
$1N81168: FPC1.17 R77.2
$1N85586: R81.1 USB3.B5
$1N85625: R82.2 USB3.A5
$1N96765: R76.2 U33.14
$1N102666: C115.2 U33.73
$1N105569: C116.2 U33.48

Pads without a net: FPC1 1 2 24; U2 2 3 10; U4 3 5 6 7 14 15; U9 2 3 18 21 22 23 24 25 26 27 28 29; U15 2 3 18 21 22 23 24 25 26 27 28 29; U18 2 3 18 21 22 23 24 25 26 27 28 29; U23 2 3 18 21 22 23 24 25 26 27 28 29; U27 4 5 7 9 13 15 16 17 18; U33 1 2 7 8 9 15 16 17 18 20 22 23 29 31 32 33 37 38 39 40 45 55 56 57 58 59 60 61 62 67 72 76 81 82 83 84 85 86 87 88 89 90 91; USB3 A8 B8

## Via types
v1: diameter 0.61, hole 0.305, Top Layer to Bottom Layer, 402 vias

## Routing (per net, layer and track width the routed paths; a pad name or vN(x,y) marks a point on that pad's centre or on a via; arc(x,y) is an arc through that point)
1.2V: length 3.6
  Top Layer w0.508: 42.18,71.87 42.18,72.97 C108.2 42.04,73.26 v1(42.04,74.04)
  Bottom Layer w0.254: FPC1.15 41.93,74.15 v1(42.04,74.04)
2.8V: length 3.4
  Top Layer w0.508: v1(38.86,74.04) 38.82,74 C109.2 38.75,73.08 U30.2
  Bottom Layer w0.254: FPC1.21 38.93,74.11 v1(38.86,74.04)
3V3: length 279.3
  Top Layer w0.254: v1(72.75,37.96) 73.74,37.96 L4.1 ; v1(79.55,45.17) C79.2 79.4,44.28 U33.27 ; v1(55.5,50.8) 55.94,50.36 C53.1 56.15,49.98 U4.13 ; v1(60.2,51.77) 60.2,52.13 C52.1 ; v1(38.86,77.98) 40.46,76.38 v1(42.42,76.38) 42.42,76.38 43.62,75.18 47.96,75.18 49.02,74.12 49.02,70.8 53.27,66.55 55.75,66.55 v1(59.06,63.25) 59.51,62.79 61.06,62.79 R79.1 ; v1(67.44,40.77) 66.86,41.35 U33.6 ; 75.88,62.07 75.88,63.51 C28.1 75.76,63.82 v1(76.58,64.64) 77.53,63.69 C29.1 77.18,63.27 U3.8 ; U33.75 64.36,58.8 C77.2 64.17,60.29 64.01,60.45 v1(64.01,60.71) ; U2.5 56.65,58.53 C27.2 56.31,58.24 v1(55.57,58.98) ; C106.1 59.51,59.96 U2.8 ; v1(78.68,56.45) 79.27,56.45 79.46,56.26 78.99,55.78 U33.50 ; U4.2 59,52.2 C52.1 ; U4.4 59.13,53.2 C52.1 ; C81.2 60.96,43.14 v1(62.67,43.14) 62.81,43.28 U33.100 ; U33.11 69.36,40.74 C80.2 v1(69.25,39.9) 69.25,39.2 69.47,38.99 R76.1
  Top Layer w0.635: v1(50.67,48.89) 50.2,49.37 50.2,50.33 ; C106.1 60.99,59.9 C25.2 61.09,59.05 v1(61.03,59) ; U12.1 57.91,38.86 v1(59.31,40.26) 59.88,40.26 C94.1 60.83,41.59 C81.2
  Power w0.508: v1(15.06,38.24) 22.93,38.24 v1(29.16,44.46) ; v1(79.55,45.17) 81.08,45.17 85.74,40.51 86.81,40.51 87.53,39.8 87.53,38.73 v1(88.16,38.1) 96.03,38.1 v1(102.25,44.32) ; v1(38.86,77.98) 34.7,82.14 29.02,82.14 29.01,82.16 28,82.16 27.98,82.14 v1(26.66,82.14) 18.78,82.14 v1(12.56,75.92) ; v1(76.58,64.64) 76.58,66.95 81.9,72.26 81.9,73.18 82.18,73.46 83.1,73.46 v1(85.58,75.95) 91.8,82.17 v1(99.68,82.17)
  Bottom Layer w0.254: R78.1 39.8,77.98 v1(38.86,77.98) ; C105.2 v1(42.42,76.38) 42.42,75.34 FPC1.14
  Bottom Layer w0.508: 12.93,76.66 13.34,76.25 R2.1 15.64,76.25 15.67,76.22 15.29,75.84 C31.1 ; 12.93,76.66 L1.2 ; 12.93,76.66 12.93,76.29 v1(12.56,75.92) ; L2.2 101.88,43.58 ; 101.88,43.58 101.88,43.95 v1(102.25,44.32) ; 101.88,43.58 101.47,43.99 R34.1 99.17,43.99 U15.1 99.53,44.4 C43.1 ; U9.17 24.16,83.02 C22.2 25.59,82.14 v1(26.66,82.14) ; v1(15.06,38.24) 16.13,38.24 C61.2 17.56,37.36 17.56,38.56 ; L3.2 85.95,76.69 ; 85.95,76.69 85.95,76.32 v1(85.58,75.95) ; 85.95,76.69 86.36,76.28 R36.1 88.66,76.28 U18.1 88.31,75.87 C63.1 ; v1(99.68,82.17) 98.61,82.17 C66.2 97.18,83.05 U18.17 ; L5.2 28.79,43.72 ; 28.79,43.72 28.38,44.13 R57.1 26.07,44.13 U23.1 26.43,44.54 C75.1 ; 28.79,43.72 28.79,44.09 v1(29.16,44.46) 34.98,50.29 49.28,50.29 50.55,49.02 ; U15.17 90.66,37.22 C40.2 89.22,38.1 v1(88.16,38.1)
  Bottom Layer w0.635: U8.1 30.03,43.59 v1(29.16,44.46) ; R11.1 58.67,46.24 v1(58.17,46.74) ; U27.8 67.57,51.37 68.65,50.29 v1(69.09,50.29) 69.09,51.65 69.77,52.32 U27.6 ; U5.1 11.69,76.79 v1(12.56,75.92) ; v1(60.2,51.77) 60.2,51.18 60.82,50.55 R12.1 ; U6.1 103.13,43.45 v1(102.25,44.32) ; v1(50.67,48.89) 50.55,49.02 49.57,49.02 ; v1(85.58,75.95) 84.71,76.82 U35.1
  Bottom Layer w1.27: C99.1 57.99,42.89 v1(57.61,42.89)
  Bottom Layer w1.524: C99.1 58.92,39.97 58.37,39.43
5V_USB: length 15.6
  Top Layer w0.254: 63.73,31.24 64.8,31.24 66.69,33.12 68.12,33.12 68.61,33.61 68.61,34.13 ; 68.61,34.13 68.33,34.41 68.33,35.05 68.32,35.05 USB3.A4 ; 68.61,34.13 68.61,35.04 USB3.B9 68.62,35.06 68.62,36.05 69.78,37.21 71.65,37.21 73.05,35.82 73.05,35.12 USB3.B4
7.4V_BATTERY: length 227.6
  Top Layer w6.35: 9.39,95.05 32.55,95.05 ; 32.33,25.33 9.17,25.33 ; 82.41,95.08 105.56,95.08 ; 105.42,25.19 82.27,25.19
  Bottom Layer w0.635: 42.1,35.35 42.1,36.12 42.88,36.12 42.88,35.35 ; U11.2 U11.3
  Bottom Layer w1.016: U14.1 103.77,21.02 C37.2 102.03,24.81 v1(101.65,25.19) ; v1(16.97,95.05) 23.07,95.05 24.59,96.57 C6.2 22.85,99.22 U10.1 ; U24.1 18.87,21.16 C59.2 17.12,23.81 18.65,25.33 v1(24.74,25.33) ; U22.1 107.68,99.25 C70.2 109.42,96.6 107.9,95.08 v1(101.8,95.08) ; U17.1 7.06,21.16 C57.2 5.31,23.81 6.84,25.33 v1(12.93,25.33) ; U19.1 30.68,21.16 C58.2 28.94,24.95 v1(28.55,25.33) ; v1(97.84,25.19) 91.74,25.19 90.22,23.67 C38.2 91.96,21.02 U16.1 ; U13.1 80.15,21.02 C36.2 78.41,23.67 79.93,25.19 v1(86.03,25.19) ; v1(28.79,95.05) 34.88,95.05 36.41,96.57 C4.2 34.66,99.22 U1.1 ; U7.1 11.04,99.22 C5.2 12.78,95.43 v1(13.16,95.05) ; v1(86.18,95.08) 85.8,95.46 C55.2 84.06,99.25 U20.1 ; v1(89.99,95.08) 96.09,95.08 97.61,96.6 C68.2 95.87,99.25 U21.1
  Bottom Layer w1.27: U11.3 v1(42.45,36.88) v1(42.45,37.65) v1(42.45,38.32) v1(42.45,39.05) 42.45,39.76 43.6,38.61 C96.2
  vias: v1(18.54,53.09) v1(18.92,54.99) v1(19.43,52.07) v1(19.56,49.66) v1(20.7,50.16) v1(21.59,54.61) v1(21.97,51.69) v1(23.8,49.14) v1(24,54.36) v1(24,50.8) v1(25.27,52.45) v1(25.53,49.78) v1(26.8,51.18) v1(36.7,41.15) v1(37.12,38.81) v1(37.59,42.67) v1(37.97,44.32) v1(38.1,40.77) v1(38.35,39.5) v1(38.48,41.66) v1(38.73,42.98) v1(38.74,38.23) v1(39.62,37.72) v1(40.26,43.43) v1(40.26,38.35) v1(40.77,37.46) v1(41.78,43.43) v1(43.18,42.8) v1(43.81,40.39) v1(44.07,42.42) v1(44.07,41.27) v1(76.49,37.67) v1(76.49,36.4) v1(76.49,32.59) v1(77.76,38.94) v1(77.76,37.67) v1(77.76,36.4) v1(77.76,35.13) v1(77.76,33.86) v1(77.76,32.59) v1(77.76,31.32) v1(77.76,30.05) v1(79.03,38.94) v1(79.03,37.67) v1(79.03,36.4) v1(79.03,35.13) v1(79.03,33.86) v1(79.03,32.59) v1(79.03,31.32) v1(79.03,30.05) v1(80.3,38.94) v1(80.3,37.67) v1(80.3,36.4) v1(80.3,35.13) v1(80.3,33.86) v1(80.3,32.59) v1(80.3,31.32) v1(80.3,30.05) v1(81.57,38.94) v1(81.57,37.67) v1(81.57,36.4) v1(81.57,35.13) v1(81.57,33.86) v1(81.57,32.59) v1(81.57,31.32) v1(82.84,38.94) v1(82.84,37.67) v1(82.84,36.4) v1(82.84,35.13) v1(82.84,33.86) v1(82.84,32.59) v1(84.11,38.94) v1(84.11,37.67) v1(84.11,36.4) v1(84.11,35.13)
+5V: length 60.5
  Top Layer w0.508: C107.2 43.13,68.41 U29.3 ; U30.3 39.7,68.29 C110.2
  Top Layer w0.635: 41.36,66.8 43.94,64.22 H2.2 ; 41.36,66.8 42.55,66.8 43.22,67.47 C107.2 ; 41.36,66.8 40.39,66.8 39.79,67.4 C110.2
  Power w0.635: H2.2 45.59,43.69 51.18,43.69 56.13,38.73 56.13,33.91 58.93,31.11
  Bottom Layer w1.016: C1.2 59.88,31.11 U34.2 59.44,33.35 U25.1
GND: length 288.4
  Top Layer w0.254: U2.6 57.15,58.84 58.59,57.4 v1(58.8,57.4) ; U2.7 57.75,59.59 C27.1 ; v1(65.06,59.74) 65.01,59.69 C77.1 64.86,58.84 U33.74 ; C93.1 73.75,39.38 73.3,39.83 73.3,40.06 C92.1 73.36,40.9 U33.19 ; v1(79.55,42.82) C79.1 79.36,43.78 U33.26 ; 80.34,56.22 80.34,56.08 79.97,55.71 79.59,55.71 79.16,55.28 U33.49 ; v1(76.55,62.81) 76.53,62.79 U3.7 ; C51.2 54.54,54.29 v1(55.14,53.69) U4.9 ; C81.1 61.26,44.28 61.38,44.28 ; 61.38,44.28 v1(61.52,44.28) U33.99 ; 61.38,44.28 60.71,44.96 R33.2 ; C80.1 68.41,40.84 68.86,41.29 U33.10 68.87,42.24 v1(68.87,43.53) ; C53.2 54.55,51.11 v1(54.84,51.41) 55.13,51.7 55.13,51.94 55.29,52.1 55.54,52.1 U4.11 ; R74.2 79.96,49.96 v1(80.26,49.66) ; U2.11 61.04,61.46 C25.1 60.43,60.74 C106.2 59.27,60.46 U2.9 ; v1(74.38,64.72) 74.36,64.7 C28.2 ; U3.1 77.63,60.62 v1(78.49,61.47) 78.93,61.91 C29.2
  Top Layer w0.508: 44.06,68.33 44.08,68.35 v1(44.08,70.82) U29.1 44.08,72.05 C108.1 ; C110.1 40.65,68.22 v1(40.65,70.88) 40.65,71.85 ; U30.1 40.65,72.16 C109.1 ; C116.1 81.34,55.37 v1(80.99,55.73) 80.46,56.26 C78.1
  Top Layer w0.635: H2.1 40.69,45.34 U32.10 ; C52.2 59.56,54.86 v1(60.45,55.75) ; U32.9 35.99,61.14 v1(35.05,60.2) ; U32.9 37.68,59.27 v1(36.96,58.55) ; U32.9 39.7,61.14 v1(40.39,60.45) ; U32.8 50.2,59.98 v1(50.42,60.2) ; v1(63.12,39.88) 62.42,40.57 C94.2 ; v1(67.56,61.34) 67.88,61.01 C115.1
  Top Layer w0.889: USB3.A1 67.2,35.05 USB3.1 ; USB3.A12 74.54,35.05 USB3.2
  Top Layer w1.143: Q7.3 27.34,109.55 v1(26.51,108.72) ; v1(76.49,11.52) 75.66,10.69 Q18.3 ; Q2.3 88.55,109.58 v1(87.72,108.75) ; v1(88.3,11.52) 87.47,10.69 Q13.3 ; Q6.3 112.17,109.58 v1(111.34,108.75) ; v1(3.4,11.66) 2.57,10.83 2.57,10.43 ; Q10.3 15.53,109.55 v1(14.7,108.72) ; v1(100.12,11.52) 99.29,10.69 Q16.3 ; 26.19,10.43 26.19,10.83 v1(27.02,11.66) ; 14.38,10.43 14.38,10.83 v1(15.21,11.66) ; Q12.3 39.15,109.55 v1(38.32,108.72) ; v1(99.53,108.75) 100.36,109.58 Q4.3
  Bottom Layer w0.254: R77.1 v1(41.71,77.9) 42.41,77.9 C105.1 v1(43.14,77.89) 43.78,77.25 C103.1 44.43,76.85 FPC1.10 ; U27.1 75.27,54.27 v1(74.93,54.61) ; FPC1.23 37.93,76.19 v1(37.67,76.45) ; C112.2 70.52,46.66 69.65,45.78 C113.2 ; U31.4 v1(71.94,48.77)
  Bottom Layer w0.508: U9.32 v1(16.37,74.04) 15.85,73.52 C31.2 15.13,73.36 R1.2 ; H5.1 14.43,35.69 C61.1 18.21,35.69 19,36.48 U23.16 ; U15.32 v1(98.44,46.2) 98.96,46.72 C43.2 99.68,46.88 R3.2 ; U18.16 95.73,83.93 96.53,84.73 C66.1 100.31,84.73 H1.1 ; C96.1 46.24,38.55 v1(46.24,36.86) 45.68,36.3 U11.4 ; 84.59,79.45 84.09,79.45 C2.1 ; 84.59,79.45 C89.2 ; 84.59,79.45 84.56,79.47 v1(84.56,80.14) ; H3.1 27.29,84.7 C22.1 23.51,84.7 22.71,83.9 U9.16 ; C10.1 30.65,40.96 30.15,40.96 ; 30.15,40.96 30.17,40.94 v1(30.17,40.27) ; 30.15,40.96 C12.2 ; C9.1 103.75,40.82 103.24,40.82 ; 103.24,40.82 102.61,40.82 ; 103.24,40.82 103.27,40.79 v1(103.27,40.13) ; 86.84,73.39 88.15,73.39 C63.2 88.87,73.55 v1(89.39,74.07) 90.13,74.81 ; 11.57,79.42 11.07,79.42 C8.1 ; 11.57,79.42 C3.2 ; 11.57,79.42 11.55,79.45 v1(11.55,80.11) ; H4.1 87.53,35.54 C40.1 91.3,35.54 92.1,36.34 U15.16 ; R10.2 26.59,47.02 C75.2 25.87,46.86 v1(25.35,46.34) U23.32
  Bottom Layer w0.635: v1(28.94,18.68) C58.1 31.98,16.71 U19.7 ; C100.1 65.65,51.76 v1(65.65,52.51) ; U27.12 68.67,61.93 68.07,61.34 v1(67.56,61.34) 66.93,61.34 66.47,61.8 U27.10 ; v1(47.62,48.51) 48.22,48.51 C114.2 ; U24.7 20.17,16.71 C59.1 v1(17.12,18.68) ; v1(97.61,101.73) C68.1 94.57,103.7 U21.7 ; v1(85.8,101.73) C55.1 82.75,103.7 U20.7 ; v1(109.42,101.73) C70.1 106.38,103.7 U22.7 ; v1(12.78,101.7) C5.1 9.73,103.67 9.73,104.4 ; v1(78.41,18.54) C36.1 81.46,16.57 U13.7 ; v1(90.22,18.54) C38.1 93.27,16.57 U16.7 ; U14.7 105.08,16.57 C37.1 v1(102.03,18.54) ; U1.7 33.36,103.67 C4.1 v1(36.41,101.7) ; U17.7 8.36,16.71 C57.1 v1(5.31,18.68) ; C1.1 62.55,33.72 v1(62.36,33.91) ; U10.7 21.55,103.67 C6.1 v1(24.59,101.7)
  Bottom Layer w0.762: 40.84,32.53 40.84,30.77
  Bottom Layer w1.016: USB3.2 75.19,33.16 74.42,32.4 ; v1(34.93,75.18) v1(35.49,74.62) 35.74,74.37 FPC1.25 ; R82.1 66.55,33.69 USB3.1 ; v1(51.44,75.31) 50.62,74.5 FPC1.26
  Bottom Layer w1.143: R21.1 v1(79.61,90.56) ; R30.1 v1(103.23,90.56) ; R63.1 v1(23.32,29.85) ; R64.1 v1(35.13,29.85) ; R41.1 v1(84.6,29.71) ; R24.1 v1(91.42,90.56) ; R4.1 v1(30.21,90.54) ; R15.1 v1(6.59,90.54) ; R46.1 v1(96.41,29.71) ; R47.1 v1(108.22,29.71) ; R58.1 v1(11.5,29.85) ; R9.1 v1(18.4,90.54)
  Bottom Layer w1.27: C96.1 48.39,40.81 CN1.1
  Bottom Layer w1.524: U25.2 v1(61.22,36.7) U25.4 63.12,37.63 v1(63.12,39.88) 63.12,40.81 C99.2
  vias: v1(40.85,31.75) v1(46.1,42.42) v1(50.29,38.99) v1(50.59,42.81) v1(50.82,74.69) v1(51.31,40.13) v1(51.56,41.53) v1(52.71,40.13) v1(52.96,43.31) v1(53.97,42.42) v1(54.86,41.53) v1(55.88,40.64) v1(60.07,61.47) v1(69.8,45.94) v1(73.34,39.88)
VDDA: length 4.4
  Top Layer w0.254: L4.2 C93.2 C92.2 74.59,40.87 74.36,41.1 U33.21
$1I45090\$1N2344: length 2.1
  Top Layer w0.762: Q5.1 107.37,102.73 R40.2
$1I45090\$1N2345: length 2.8
  Top Layer w0.762: R40.1 105.62,101.23 v1(105.23,100.84)
  Bottom Layer w0.762: v1(105.23,100.84) 105.11,100.71 U22.3
$1I45090\$1N2351: length 2.6
  Bottom Layer w0.762: R37.1 96.69,105.28 U21.8
$1I45090\$1N2352: length 3.2
  Top Layer w0.762: v1(99.22,106.65) 100.39,105.48 100.39,105.46
  Bottom Layer w0.762: v1(99.22,106.65) 99.54,106.32 R37.2
$1I45090\$1N2355: length 2.5
  Bottom Layer w0.508: U21.2 94.57,97.72 C69.2
$1I45090\$1N2357: length 2.8
  Top Layer w0.762: v1(93.42,100.84) 93.81,101.23 R38.1
  Bottom Layer w0.762: v1(93.42,100.84) 93.3,100.71 U21.3
$1I45090\$1N2360: length 2.6
  Bottom Layer w0.762: U20.8 84.88,105.28 R13.1
$1I45090\$1N2365: length 2.1
  Top Layer w0.762: R38.2 95.56,102.73 Q3.1
$1I45090\$1N2366: length 3.2
  Top Layer w0.762: v1(87.4,106.65) 88.58,105.48 88.58,105.46
  Bottom Layer w0.762: R13.2 87.73,106.32 v1(87.4,106.65)
$1I45090\$1N2369: length 2.5
  Bottom Layer w0.508: U20.2 82.75,97.72 C67.2
$1I45090\$1N2370: length 2.8
  Top Layer w0.762: R14.1 82,101.23 v1(81.61,100.84)
  Bottom Layer w0.762: U20.3 81.48,100.71 v1(81.61,100.84)
$1I45090\$1N2372: length 2.1
  Top Layer w0.762: Q1.1 83.75,102.73 R14.2
$1I45090\$1N2388: length 2.3
  Bottom Layer w0.508: R36.2 87.66,78.65 U18.4
$1I45090\$1N2393: length 2.5
  Bottom Layer w0.508: U22.2 106.38,97.72 C71.2
$1I45090\$1N2396: length 2.6
  Bottom Layer w0.762: R39.1 108.51,105.28 U22.8
$1I45090\$1N2398: length 3.2
  Top Layer w0.762: 112.2,105.46 112.2,105.48 v1(111.03,106.65)
  Bottom Layer w0.762: R39.2 111.35,106.32 v1(111.03,106.65)
$1I45090\$1N2406: length 5.8
  Bottom Layer w0.508: U18.5 88.69,79.45 C89.1 86.07,78.76 L3.1 84.43,78.09 C2.2
$1I45090\A_REF: length 31.9
  Power w1.016: v1(83.72,88.73) v1(86.25,86.2) 89.01,83.44 v1(89.01,82.93) 89.48,83.4 96.04,83.4 v1(99.34,86.7)
  Bottom Layer w0.508: 90.13,83.29 89.77,82.93 v1(89.01,82.93)
  Bottom Layer w1.016: v1(99.34,86.7) 100.31,87.67 R29.1 ; v1(86.25,86.2) 88.54,88.49 88.54,89.12 ; v1(83.72,88.73) 83.72,89.54 R20.1
$1I45090\AU: length 26.2
  Bottom Layer w0.508: v1(78.1,92.19) 78.1,89.02 86.86,80.25 U18.6
  Bottom Layer w1.016: R20.2 R21.2 79.24,93.34 v1(78.1,92.19) 78.09,92.18 R19.1
$1I45090\AV: length 24.7
  Bottom Layer w0.508: U18.7 87.22,81.05 84.86,83.41 84.86,87.15 v1(88.48,90.76)
  Bottom Layer w1.016: R22.1 88.48,95.74 v1(88.48,90.76) 91.05,93.34 R24.2
$1I45090\AW: length 31.4
  Bottom Layer w0.508: U18.8 87.57,81.85 86.49,82.93 86.49,84.26 91,88.77 98.3,88.77 v1(100.32,90.8)
  Bottom Layer w1.016: R28.1 100.32,95.78 v1(100.32,90.8) 102.86,93.34 R30.2
$1I45090\BOOT0_ESC: length 11.9
  Bottom Layer w0.508: U18.31 90.93,73.24 90.21,72.52 R75.1 83.79,69.47 U35.2
$1I45090\PHASE_U: length 20.1
  Top Layer w2.032: 79.88,105.09 Q1.3 79.88,101.9 v1(78.56,100.58)
  Top Layer w6.35: Q2.2 81.6,115.9 NOREF#4.1
  Bottom Layer w0.508: U20.4 80.21,97.47 C67.1
  Bottom Layer w1.016: v1(78.56,100.58) 79.86,99.28 U20.4
  Bottom Layer w1.143: R19.2 78.09,100.11 v1(78.56,100.58)
$1I45090\PHASE_V: length 20.1
  Top Layer w2.032: 91.69,105.09 Q3.3 91.69,101.9 v1(90.37,100.58)
  Top Layer w6.35: NOREF#10.1 93.41,115.93 Q4.2
  Bottom Layer w0.508: U21.4 92.03,97.47 C69.1
  Bottom Layer w1.016: v1(90.37,100.58) 91.67,99.28 U21.4
  Bottom Layer w1.143: R22.2 89.9,100.11 v1(90.37,100.58)
$1I45090\PHASE_W: length 20.1
  Top Layer w2.032: v1(102.19,100.58) 103.5,101.9 Q5.3 103.5,105.09
  Top Layer w6.35: NOREF#3.1 105.22,115.9 Q6.2
  Bottom Layer w0.508: U22.4 103.84,97.47 C71.1
  Bottom Layer w1.016: v1(102.19,100.58) 103.49,99.28 U22.4
  Bottom Layer w1.143: R28.2 101.71,100.11 v1(102.19,100.58)
$1I45090\UH: length 34.5
  Power w0.508: v1(88.95,85.17) 77.71,96.41 v1(77.71,106.81)
  Bottom Layer w0.508: v1(88.95,85.17) 89.06,85.28 90.72,85.28 91.54,84.45 91.54,84.19 91.56,84.17 91.56,83.46 U18.11 ; v1(77.71,106.81) 78.6,106.81 80.21,105.19 U20.5
$1I45090\UL: length 42.6
  Power w0.508: v1(87.63,83.06) 81.41,89.28 79.25,89.28 76.81,91.72 v1(76.81,107.95)
  Bottom Layer w0.508: v1(76.81,107.95) 79.23,107.95 81.48,105.7 U20.6 ; U18.10 90.93,84.2 90.46,84.67 89.74,84.67 88.13,83.06 v1(87.63,83.06)
$1I45090\USART1_RX: length 4.8
  Bottom Layer w0.508: U18.20 100.5,79.45 H1.3
$1I45090\USART1_TX: length 4.6
  Bottom Layer w0.508: U18.19 100.81,80.25 H1.2
$1I45090\VH: length 30.6
  Power w0.508: v1(95.19,87.58) 95.19,93.32 89.49,99.02 89.49,106.81
  Bottom Layer w0.508: U21.5 92.03,105.19 90.41,106.81 v1(89.52,106.81) ; v1(95.19,87.58) 93.33,85.73 U18.13
$1I45090\VL: length 33
  Power w0.508: v1(91.36,86.82) 90.04,88.14 90.04,92.2 88.71,93.53 88.71,107.95
  Bottom Layer w0.508: U21.6 93.3,105.7 91.04,107.95 v1(88.75,107.95) ; 92.53,83.29 92.53,85.65 v1(91.36,86.82)
$1I45090\WH: length 36.9
  Power w0.508: 101.3,106.81 101.81,106.3 101.81,103.26 105.28,99.78 105.28,89.36 v1(102.74,86.82)
  Bottom Layer w0.508: v1(102.74,86.82) 101.98,86.82 100.69,85.53 95.44,85.53 94.93,85.02 U18.15 ; v1(101.33,106.81) 102.22,106.81 103.84,105.19 U22.5
$1I45090\WL: length 35.2
  Power w0.508: v1(98.87,87.96) 98.87,100.69 100.52,102.35 100.52,107.95
  Bottom Layer w0.508: v1(98.87,87.96) 97.27,86.36 95.38,86.36 94.2,85.18 94.2,83.36 94.13,83.29 ; U22.6 105.11,105.7 102.85,107.95 v1(100.56,107.95)
$1I45112\$1N2344: length 2.1
  Top Layer w0.762: Q8.1 34.35,102.71 R18.2
$1I45112\$1N2345: length 2.8
  Top Layer w0.762: v1(32.21,100.81) 32.6,101.2 33.23,101.2
  Bottom Layer w0.762: v1(32.21,100.81) 32.09,100.68 U1.3
$1I45112\$1N2351: length 2.6
  Bottom Layer w0.762: R25.1 23.68,105.26 U10.8
$1I45112\$1N2352: length 3.2
  Top Layer w0.762: v1(26.2,106.62) 27.37,105.45 27.37,105.43
  Bottom Layer w0.762: R25.2 26.52,106.3 v1(26.2,106.62)
$1I45112\$1N2355: length 2.5
  Bottom Layer w0.508: U10.2 21.55,97.7 C24.2
$1I45112\$1N2357: length 2.8
  Top Layer w0.762: v1(20.4,100.81) 20.79,101.2 21.42,101.2
  Bottom Layer w0.762: v1(20.4,100.81) 20.28,100.68 U10.3
$1I45112\$1N2360: length 2.6
  Bottom Layer w0.762: R27.1 11.86,105.26 U7.8
$1I45112\$1N2365: length 2.1
  Top Layer w0.762: R31.2 22.54,102.71 Q9.1
$1I45112\$1N2366: length 3.2
  Top Layer w0.762: 15.56,105.43 15.56,105.45 v1(14.38,106.62)
  Bottom Layer w0.762: v1(14.38,106.62) 14.71,106.3 14.71,105.26
$1I45112\$1N2369: length 2.5
  Bottom Layer w0.508: C7.2 9.73,97.7 9.73,99.26
$1I45112\$1N2370: length 2.8
  Top Layer w0.762: v1(8.59,100.81) 8.98,101.2 9.61,101.2
  Bottom Layer w0.762: v1(8.59,100.81) 8.47,100.68 U7.3
$1I45112\$1N2372: length 2.1
  Top Layer w0.762: Q11.1 10.73,102.71 R32.2
$1I45112\$1N2388: length 2.3
  Bottom Layer w0.508: R2.2 14.64,78.62 15.67,78.62
$1I45112\$1N2393: length 2.5
  Bottom Layer w0.508: C32.2 33.36,97.7 U1.2
$1I45112\$1N2396: length 2.6
  Bottom Layer w0.762: R26.1 35.49,105.26 U1.8
$1I45112\$1N2398: length 3.2
  Top Layer w0.762: v1(38.01,106.62) 39.18,105.45 39.18,105.43
  Bottom Layer w0.762: v1(38.01,106.62) 38.33,106.3 R26.2
$1I45112\$1N2406: length 5.8
  Bottom Layer w0.508: C8.2 11.41,78.06 L1.1 13.05,78.74 C3.1 15.67,79.42 15.67,79.42
$1I45112\A_REF: length 31.9
  Power w1.016: v1(10.7,88.7) v1(13.23,86.17) 15.99,83.41 v1(15.99,82.9) 16.46,83.37 23.02,83.37 v1(26.32,86.67)
  Bottom Layer w0.508: v1(15.99,82.9) 16.75,82.9 U9.9
  Bottom Layer w1.016: R16.1 15.52,88.46 v1(13.23,86.17) ; R5.1 27.29,87.65 v1(26.32,86.67) ; v1(10.7,88.7) 10.7,89.52 R17.1
$1I45112\AU: length 26.2
  Bottom Layer w0.508: v1(5.08,92.17) 5.08,88.99 13.84,80.22 15.67,80.22
  Bottom Layer w1.016: R17.2 R15.2 6.22,93.31 v1(5.08,92.17) 5.07,92.16 5.07,97.14
$1I45112\AV: length 24.7
  Bottom Layer w0.508: v1(15.46,90.74) 11.84,87.12 11.84,83.39 14.2,81.02 15.67,81.02
  Bottom Layer w1.016: R9.2 18.03,93.31 v1(15.46,90.74) 15.46,95.72 16.88,97.14
$1I45112\AW: length 31.4
  Bottom Layer w0.508: v1(27.3,90.77) 25.28,88.75 17.98,88.75 13.47,84.23 13.47,82.9 14.55,81.82 15.67,81.82
  Bottom Layer w1.016: R4.2 29.84,93.31 v1(27.3,90.77) 27.3,95.75 28.69,97.14
$1I45112\BOOT0_ESC: length 11.9
  Bottom Layer w0.508: U9.31 17.91,73.21 17.19,72.5 R1.1 10.77,69.45 U5.2
$1I45112\PHASE_U: length 20.1
  Top Layer w2.032: v1(5.54,100.56) 6.86,101.88 Q11.3 6.86,105.07
  Top Layer w6.35: Q10.2 8.58,115.88 NOREF#12.1
  Bottom Layer w0.508: C7.1 7.2,97.44 U7.4
  Bottom Layer w1.016: U7.4 6.84,99.26 v1(5.54,100.56)
  Bottom Layer w1.143: R8.2 5.07,100.08 v1(5.54,100.56)
$1I45112\PHASE_V: length 20.1
  Top Layer w2.032: 18.67,105.07 Q9.3 18.67,101.88 v1(17.36,100.56)
  Top Layer w6.35: Q7.2 20.39,115.91 NOREF#7.1
  Bottom Layer w0.508: U10.4 19.01,97.44 19.45,97
  Bottom Layer w1.016: U10.4 18.66,99.26 v1(17.36,100.56)
  Bottom Layer w1.143: R7.2 16.88,100.08 v1(17.36,100.56)
$1I45112\PHASE_W: length 20.1
  Top Layer w2.032: 30.49,105.07 Q8.3 30.49,101.88 v1(29.17,100.56)
  Top Layer w6.35: NOREF#11.1 32.2,115.88 Q12.2
  Bottom Layer w0.508: C32.1 30.82,97.44 U1.4
  Bottom Layer w1.016: v1(29.17,100.56) 30.47,99.26 U1.4
  Bottom Layer w1.143: R6.2 28.69,100.08 v1(29.17,100.56)
$1I45112\UH: length 34.5
  Power w0.508: v1(4.69,106.78) 4.69,96.38 v1(15.93,85.14)
  Bottom Layer w0.508: v1(15.93,85.14) 16.05,85.25 17.7,85.25 18.52,84.43 18.52,84.17 18.54,84.15 18.54,83.44 U9.11 ; U7.5 7.2,105.16 5.58,106.78 v1(4.69,106.78)
$1I45112\UL: length 42.6
  Power w0.508: v1(14.61,83.03) 8.39,89.25 6.23,89.25 3.79,91.69 v1(3.79,107.92)
  Bottom Layer w0.508: U7.6 8.47,105.67 6.21,107.92 v1(3.79,107.92) ; v1(14.61,83.03) 15.11,83.03 16.72,84.64 17.44,84.64 17.91,84.17 U9.10
$1I45112\USART1_RX: length 4.8
  Bottom Layer w0.508: H3.3 27.48,79.42 U9.20
$1I45112\USART1_TX: length 4.6
  Bottom Layer w0.508: H3.2 27.79,80.22 U9.19
$1I45112\VH: length 30.6
  Power w0.508: v1(22.17,87.55) 22.17,93.29 16.47,98.99 16.47,106.78
  Bottom Layer w0.508: v1(22.17,87.55) 20.31,85.7 U9.13 ; v1(16.5,106.78) 17.39,106.78 19.01,105.16 U10.5
$1I45112\VL: length 33
  Power w0.508: 15.69,107.92 15.69,93.5 17.02,92.17 17.02,88.11 v1(18.34,86.79)
  Bottom Layer w0.508: U9.12 19.51,85.62 v1(18.34,86.79) ; U10.6 20.28,105.67 18.02,107.92 v1(15.73,107.92)
$1I45112\WH: length 36.9
  Power w0.508: 28.28,106.78 28.79,106.27 28.79,103.23 32.26,99.76 32.26,89.33 v1(29.72,86.79)
  Bottom Layer w0.508: U1.5 30.82,105.16 29.2,106.78 v1(28.31,106.78) ; U9.15 21.91,85 22.42,85.5 27.67,85.5 28.96,86.79 v1(29.72,86.79)
$1I45112\WL: length 35.2
  Power w0.508: v1(25.85,87.93) 25.85,100.67 27.5,102.32 27.5,107.92
  Bottom Layer w0.508: U1.6 32.09,105.67 29.83,107.92 v1(27.54,107.92) ; U9.14 21.18,83.33 21.18,85.16 22.36,86.33 24.25,86.33 v1(25.85,87.93)
$1I45134\$1N2344: length 2.1
  Top Layer w0.762: R50.2 80.46,17.53 Q14.1
$1I45134\$1N2345: length 2.8
  Top Layer w0.762: v1(82.6,19.43) 82.21,19.04 R50.1
  Bottom Layer w0.762: U13.3 82.73,19.56 v1(82.6,19.43)
$1I45134\$1N2351: length 2.6
  Bottom Layer w0.762: R51.1 91.14,14.99 U16.8
$1I45134\$1N2352: length 3.2
  Top Layer w0.762: v1(88.62,13.62) 87.44,14.79 87.44,14.81
  Bottom Layer w0.762: v1(88.62,13.62) 88.29,13.94 R51.2
$1I45134\$1N2355: length 2.5
  Bottom Layer w0.508: U16.2 93.27,22.54 C41.2
$1I45134\$1N2357: length 2.8
  Top Layer w0.762: R54.1 94.02,19.04 v1(94.41,19.43)
  Bottom Layer w0.762: v1(94.41,19.43) 94.54,19.56 U16.3
$1I45134\$1N2360: length 2.6
  Bottom Layer w0.762: U14.8 102.95,14.99 R53.1
$1I45134\$1N2365: length 2.1
  Top Layer w0.762: R54.2 92.27,17.53 Q15.1
$1I45134\$1N2366: length 3.2
  Top Layer w0.762: v1(100.43,13.62) 99.26,14.79 99.26,14.81
  Bottom Layer w0.762: R53.2 100.1,13.94 v1(100.43,13.62)
$1I45134\$1N2369: length 2.5
  Bottom Layer w0.508: U14.2 105.08,22.54 C39.2
$1I45134\$1N2370: length 2.8
  Top Layer w0.762: R55.1 105.83,19.04 v1(106.22,19.43)
  Bottom Layer w0.762: v1(106.22,19.43) 106.35,19.56 U14.3
$1I45134\$1N2372: length 2.1
  Top Layer w0.762: R55.2 104.09,17.53 Q17.1
$1I45134\$1N2388: length 2.3
  Bottom Layer w0.508: U15.4 100.18,41.62 R34.2
